# EAGLE design shift_regs (EAGLE 5.10)

## Sheet 1 of 3
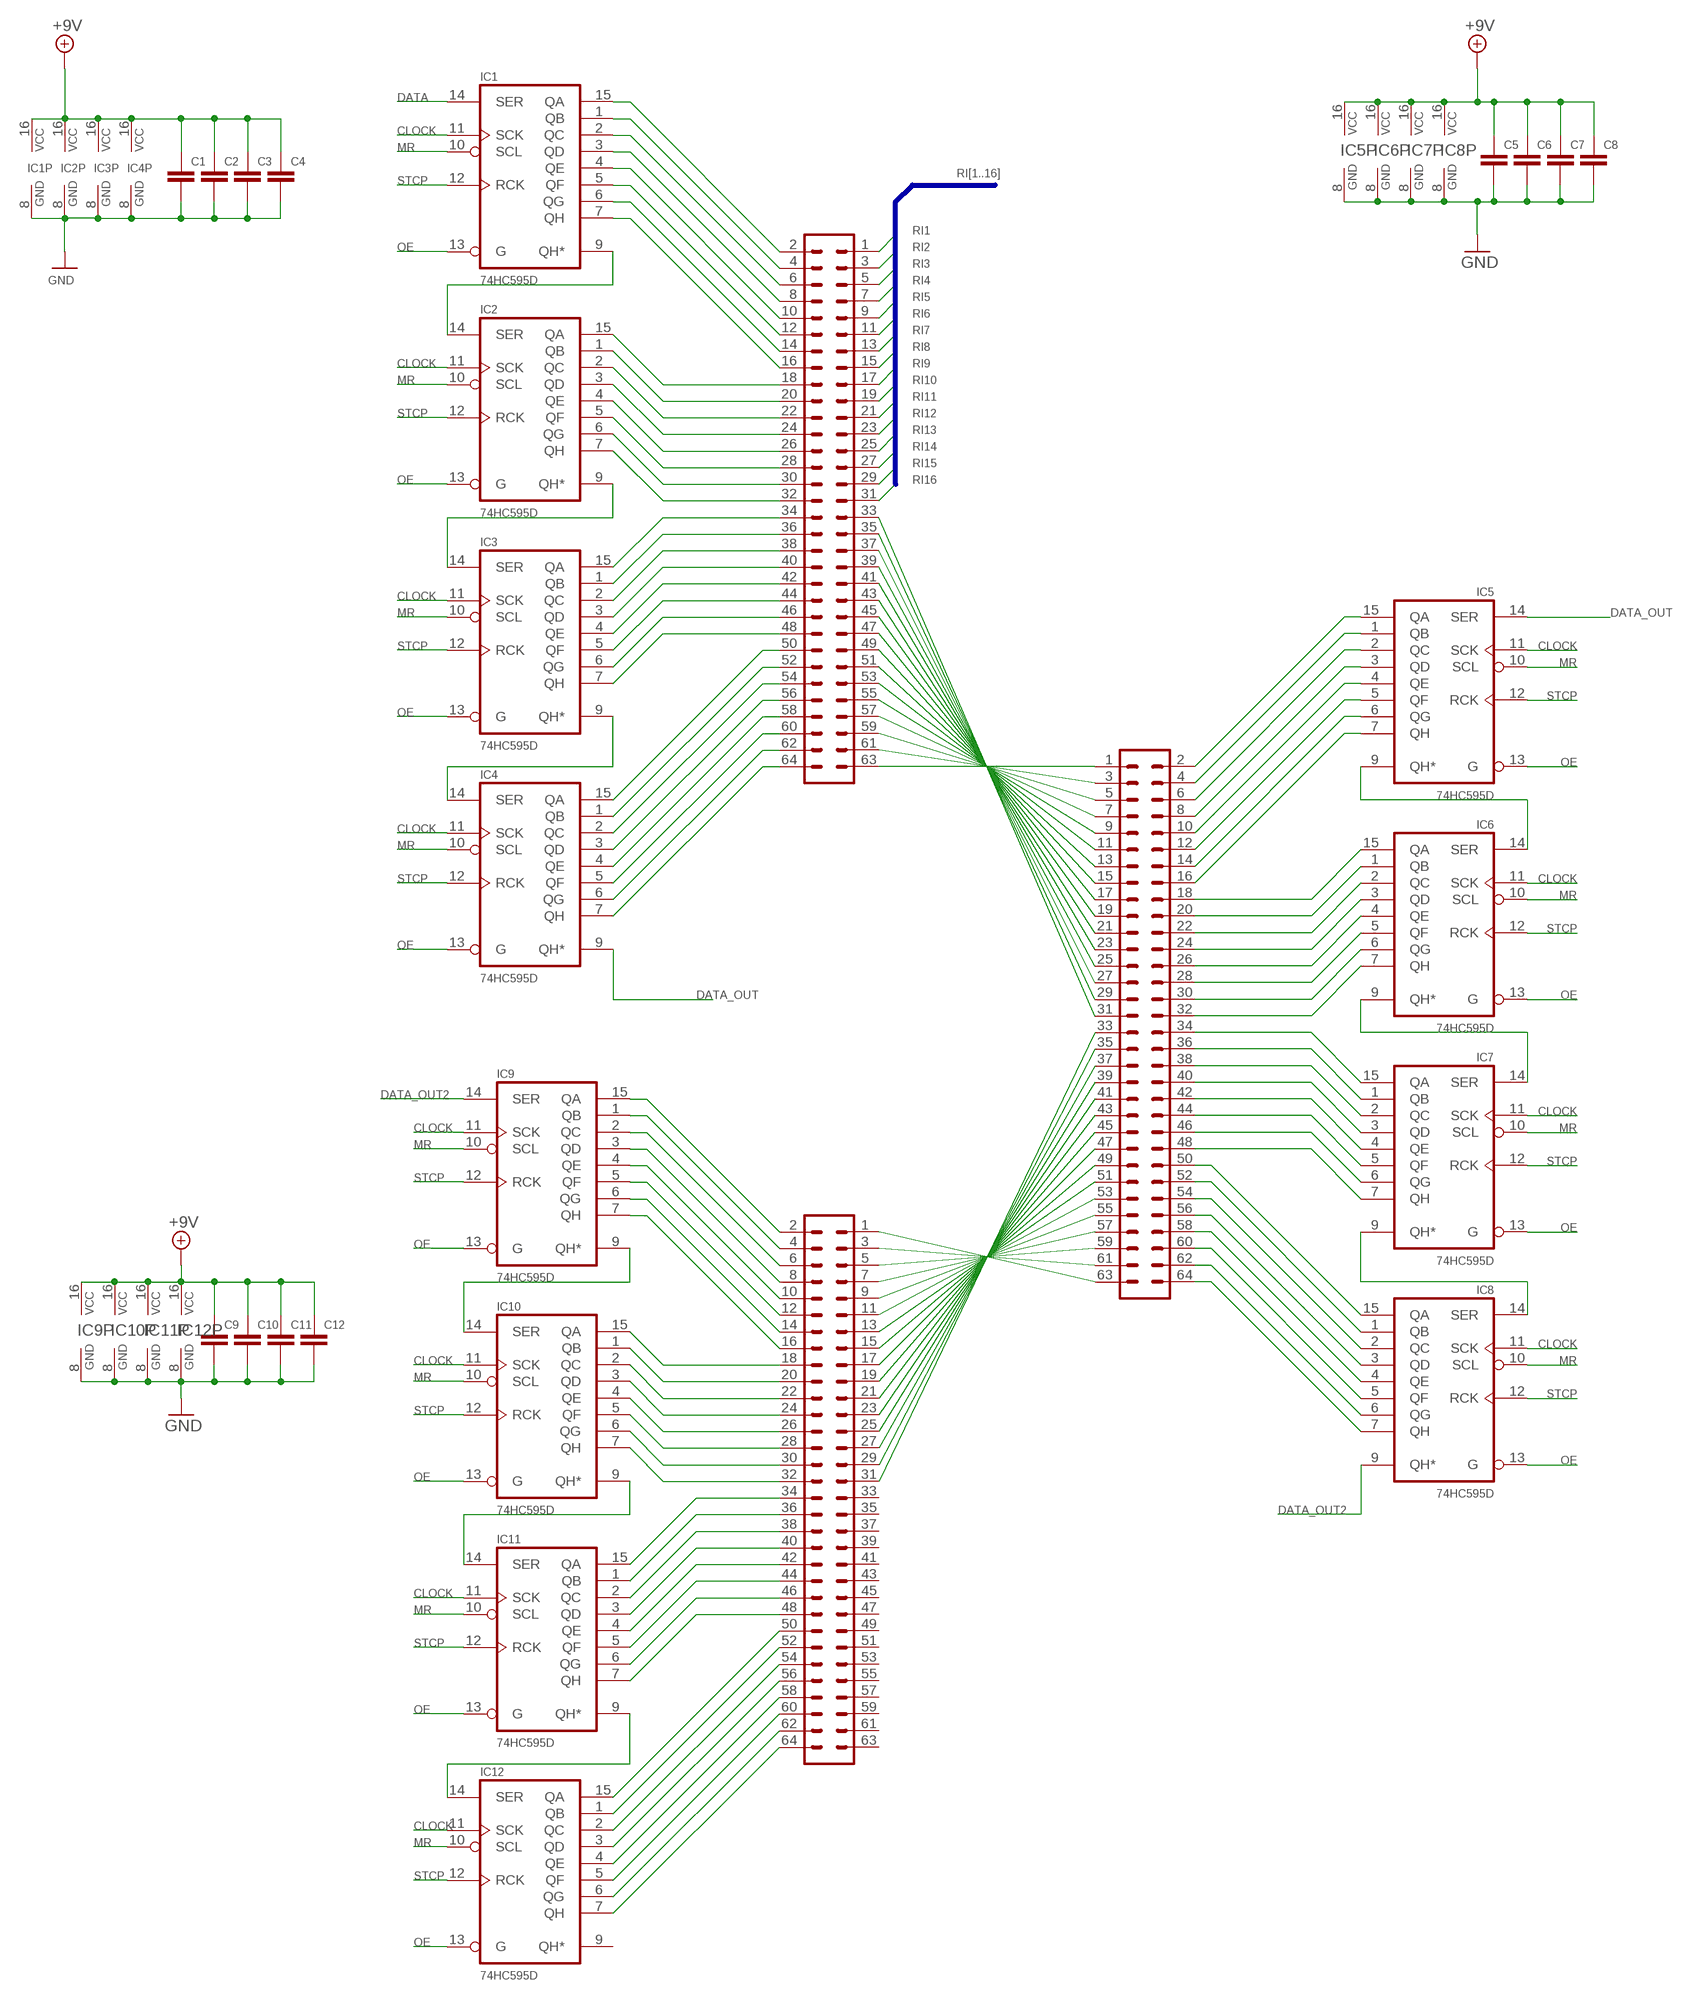
[diagram p0: schematic, sheet 1]

### Parts
C1  C-EUC0805  [C0805]
C2  C-EUC0805  [C0805]
C3  C-EUC0805  [C0805]
C4  C-EUC0805  [C0805]
C5  C-EUC0805  [C0805]
C6  C-EUC0805  [C0805]
C7  C-EUC0805  [C0805]
C8  C-EUC0805  [C0805]
C9  C-EUC0805  [C0805]
C10  C-EUC0805  [C0805]
C11  C-EUC0805  [C0805]
C12  C-EUC0805  [C0805]
IC1  74HC595D  [SO16]
IC2  74HC595D  [SO16]
IC3  74HC595D  [SO16]
IC4  74HC595D  [SO16]
IC5  74HC595D  [SO16]
IC6  74HC595D  [SO16]
IC7  74HC595D  [SO16]
IC8  74HC595D  [SO16]
IC9  74HC595D  [SO16]
IC10  74HC595D  [SO16]
IC11  74HC595D  [SO16]
IC12  74HC595D  [SO16]
SV1  ML64  [ML64]
SV2  ML64  [ML64]
SV3  ML64  [ML64]

### Nets
+9V: C1.1 C2.1 C3.1 C4.1 C5.1 C6.1 C7.1 C8.1 C9.1 C10.1 C11.1 C12.1 IC1.16(VCC) IC2.16(VCC) IC3.16(VCC) IC4.16(VCC) IC5.16(VCC) IC6.16(VCC) IC7.16(VCC) IC8.16(VCC) IC9.16(VCC) IC10.16(VCC) IC11.16(VCC) IC12.16(VCC) ; also sheet 3
CLOCK: IC1.11(SCK) IC2.11(SCK) IC3.11(SCK) IC4.11(SCK) IC5.11(SCK) IC6.11(SCK) IC7.11(SCK) IC8.11(SCK) IC9.11(SCK) IC10.11(SCK) IC11.11(SCK) IC12.11(SCK) ; also sheet 3
DATA: IC1.14(SER) ; also sheet 3
DATA_OUT: IC4.9(QH*) IC5.14(SER)
DATA_OUT2: IC8.9(QH*) IC9.14(SER)
GND: C1.2 C2.2 C3.2 C4.2 C5.2 C6.2 C7.2 C8.2 C9.2 C10.2 C11.2 C12.2 IC1.8(GND) IC2.8(GND) IC3.8(GND) IC4.8(GND) IC5.8(GND) IC6.8(GND) IC7.8(GND) IC8.8(GND) IC9.8(GND) IC10.8(GND) IC11.8(GND) IC12.8(GND) ; also sheet 2,3
MR: IC1.10(SCL) IC2.10(SCL) IC3.10(SCL) IC4.10(SCL) IC5.10(SCL) IC6.10(SCL) IC7.10(SCL) IC8.10(SCL) IC9.10(SCL) IC10.10(SCL) IC11.10(SCL) IC12.10(SCL) ; also sheet 3
N$1: IC1.9(QH*) IC2.14(SER)
N$2: IC2.9(QH*) IC3.14(SER)
N$3: IC3.9(QH*) IC4.14(SER)
N$5: IC1.1(QB) SV1.4
N$6: IC1.2(QC) SV1.6
N$7: IC1.3(QD) SV1.8
N$8: IC1.4(QE) SV1.10
N$9: IC1.5(QF) SV1.12
N$10: IC1.6(QG) SV1.14
N$11: IC1.7(QH) SV1.16
N$12: IC1.15(QA) SV1.2
N$13: IC2.1(QB) SV1.20
N$14: IC2.2(QC) SV1.22
N$15: IC2.3(QD) SV1.24
N$16: IC2.4(QE) SV1.26
N$17: IC2.5(QF) SV1.28
N$18: IC2.6(QG) SV1.30
N$19: IC2.7(QH) SV1.32
N$20: IC2.15(QA) SV1.18
N$21: IC3.1(QB) SV1.36
N$22: IC3.2(QC) SV1.38
N$23: IC3.3(QD) SV1.40
N$24: IC3.4(QE) SV1.42
N$25: IC3.5(QF) SV1.44
N$26: IC3.6(QG) SV1.46
N$27: IC3.7(QH) SV1.48
N$28: IC3.15(QA) SV1.34
N$29: IC4.1(QB) SV1.52
N$30: IC4.2(QC) SV1.54
N$31: IC4.3(QD) SV1.56
N$32: IC4.4(QE) SV1.58
N$33: IC4.5(QF) SV1.60
N$34: IC4.6(QG) SV1.62
N$35: IC4.7(QH) SV1.64
N$36: IC4.15(QA) SV1.50
N$37: IC5.9(QH*) IC6.14(SER)
N$38: IC6.9(QH*) IC7.14(SER)
N$39: IC7.9(QH*) IC8.14(SER)
N$40: IC5.1(QB) SV2.4
N$41: IC5.2(QC) SV2.6
N$42: IC5.3(QD) SV2.8
N$43: IC5.4(QE) SV2.10
N$44: IC5.5(QF) SV2.12
N$45: IC5.6(QG) SV2.14
N$46: IC5.7(QH) SV2.16
N$47: IC5.15(QA) SV2.2
N$48: IC6.1(QB) SV2.20
N$49: IC6.2(QC) SV2.22
N$50: IC6.3(QD) SV2.24
N$51: IC6.4(QE) SV2.26
N$52: IC6.5(QF) SV2.28
N$53: IC6.6(QG) SV2.30
N$54: IC6.7(QH) SV2.32
N$55: IC6.15(QA) SV2.18
N$56: IC7.1(QB) SV2.36
N$57: IC7.2(QC) SV2.38
N$58: IC7.3(QD) SV2.40
N$59: IC7.4(QE) SV2.42
N$60: IC7.5(QF) SV2.44
N$61: IC7.6(QG) SV2.46
N$62: IC7.7(QH) SV2.48
N$63: IC7.15(QA) SV2.34
N$64: IC8.1(QB) SV2.52
N$65: IC8.2(QC) SV2.54
N$66: IC8.3(QD) SV2.56
N$67: IC8.4(QE) SV2.58
N$68: IC8.5(QF) SV2.60
N$69: IC8.6(QG) SV2.62
N$70: IC8.7(QH) SV2.64
N$71: IC8.15(QA) SV2.50
N$72: SV1.63 SV2.1
N$73: SV1.61 SV2.3
N$74: SV1.59 SV2.5
N$75: SV1.57 SV2.7
N$76: SV1.55 SV2.9
N$77: SV1.53 SV2.11
N$78: SV1.51 SV2.13
N$79: SV1.49 SV2.15
N$80: SV1.47 SV2.17
N$81: SV1.45 SV2.19
N$82: SV1.43 SV2.21
N$83: SV1.41 SV2.23
N$84: SV1.39 SV2.25
N$85: SV1.37 SV2.27
N$86: SV1.35 SV2.29
N$87: SV1.33 SV2.31
N$88: IC9.9(QH*) IC10.14(SER)
N$89: IC10.9(QH*) IC11.14(SER)
N$90: IC11.9(QH*) IC12.14(SER)
N$91: IC9.1(QB) SV3.4
N$92: IC9.2(QC) SV3.6
N$93: IC9.3(QD) SV3.8
N$94: IC9.4(QE) SV3.10
N$95: IC9.5(QF) SV3.12
N$96: IC9.6(QG) SV3.14
N$97: IC9.7(QH) SV3.16
N$98: IC9.15(QA) SV3.2
N$99: IC10.1(QB) SV3.20
N$100: IC10.2(QC) SV3.22
N$101: IC10.3(QD) SV3.24
N$102: IC10.4(QE) SV3.26
N$103: IC10.5(QF) SV3.28
N$104: IC10.6(QG) SV3.30
N$105: IC10.7(QH) SV3.32
N$106: IC10.15(QA) SV3.18
N$107: IC11.1(QB) SV3.36
N$108: IC11.2(QC) SV3.38
N$109: IC11.3(QD) SV3.40
N$110: IC11.4(QE) SV3.42
N$111: IC11.5(QF) SV3.44
N$112: IC11.6(QG) SV3.46
N$113: IC11.7(QH) SV3.48
N$114: IC11.15(QA) SV3.34
N$115: IC12.1(QB) SV3.52
N$116: IC12.2(QC) SV3.54
N$117: IC12.3(QD) SV3.56
N$118: IC12.4(QE) SV3.58
N$119: IC12.5(QF) SV3.60
N$120: IC12.6(QG) SV3.62
N$121: IC12.7(QH) SV3.64
N$122: IC12.15(QA) SV3.50
N$123: SV2.33 SV3.31
N$124: SV2.35 SV3.29
N$125: SV2.37 SV3.27
N$126: SV2.39 SV3.25
N$127: SV2.41 SV3.23
N$128: SV2.43 SV3.21
N$129: SV2.45 SV3.19
N$130: SV2.47 SV3.17
N$131: SV2.49 SV3.15
N$132: SV2.51 SV3.13
N$133: SV2.53 SV3.11
N$134: SV2.55 SV3.9
N$135: SV2.57 SV3.7
N$136: SV2.59 SV3.5
N$137: SV2.61 SV3.3
N$138: SV2.63 SV3.1
OE: IC1.13(G) IC2.13(G) IC3.13(G) IC4.13(G) IC5.13(G) IC6.13(G) IC7.13(G) IC8.13(G) IC9.13(G) IC10.13(G) IC11.13(G) IC12.13(G) ; also sheet 3
RI1: SV1.1 ; also sheet 2
RI2: SV1.3 ; also sheet 2
RI3: SV1.5 ; also sheet 2
RI4: SV1.7 ; also sheet 2
RI5: SV1.9 ; also sheet 2
RI6: SV1.11 ; also sheet 2
RI7: SV1.13 ; also sheet 2
RI8: SV1.15 ; also sheet 2
RI9: SV1.17 ; also sheet 2
RI10: SV1.19 ; also sheet 2
RI11: SV1.21 ; also sheet 2
RI12: SV1.23 ; also sheet 2
RI13: SV1.25 ; also sheet 2
RI14: SV1.27 ; also sheet 2
RI15: SV1.29 ; also sheet 2
RI16: SV1.31 ; also sheet 2
STCP: IC1.12(RCK) IC2.12(RCK) IC3.12(RCK) IC4.12(RCK) IC5.12(RCK) IC6.12(RCK) IC7.12(RCK) IC8.12(RCK) IC9.12(RCK) IC10.12(RCK) IC11.12(RCK) IC12.12(RCK) ; also sheet 3
Unconnected: IC12.9(QH*) SV3.33 SV3.35 SV3.37 SV3.39 SV3.41 SV3.43 SV3.45 SV3.47 SV3.49 SV3.51 SV3.53 SV3.55 SV3.57 SV3.59 SV3.61 SV3.63

### Buses
RI[1..16]

## Sheet 2 of 3
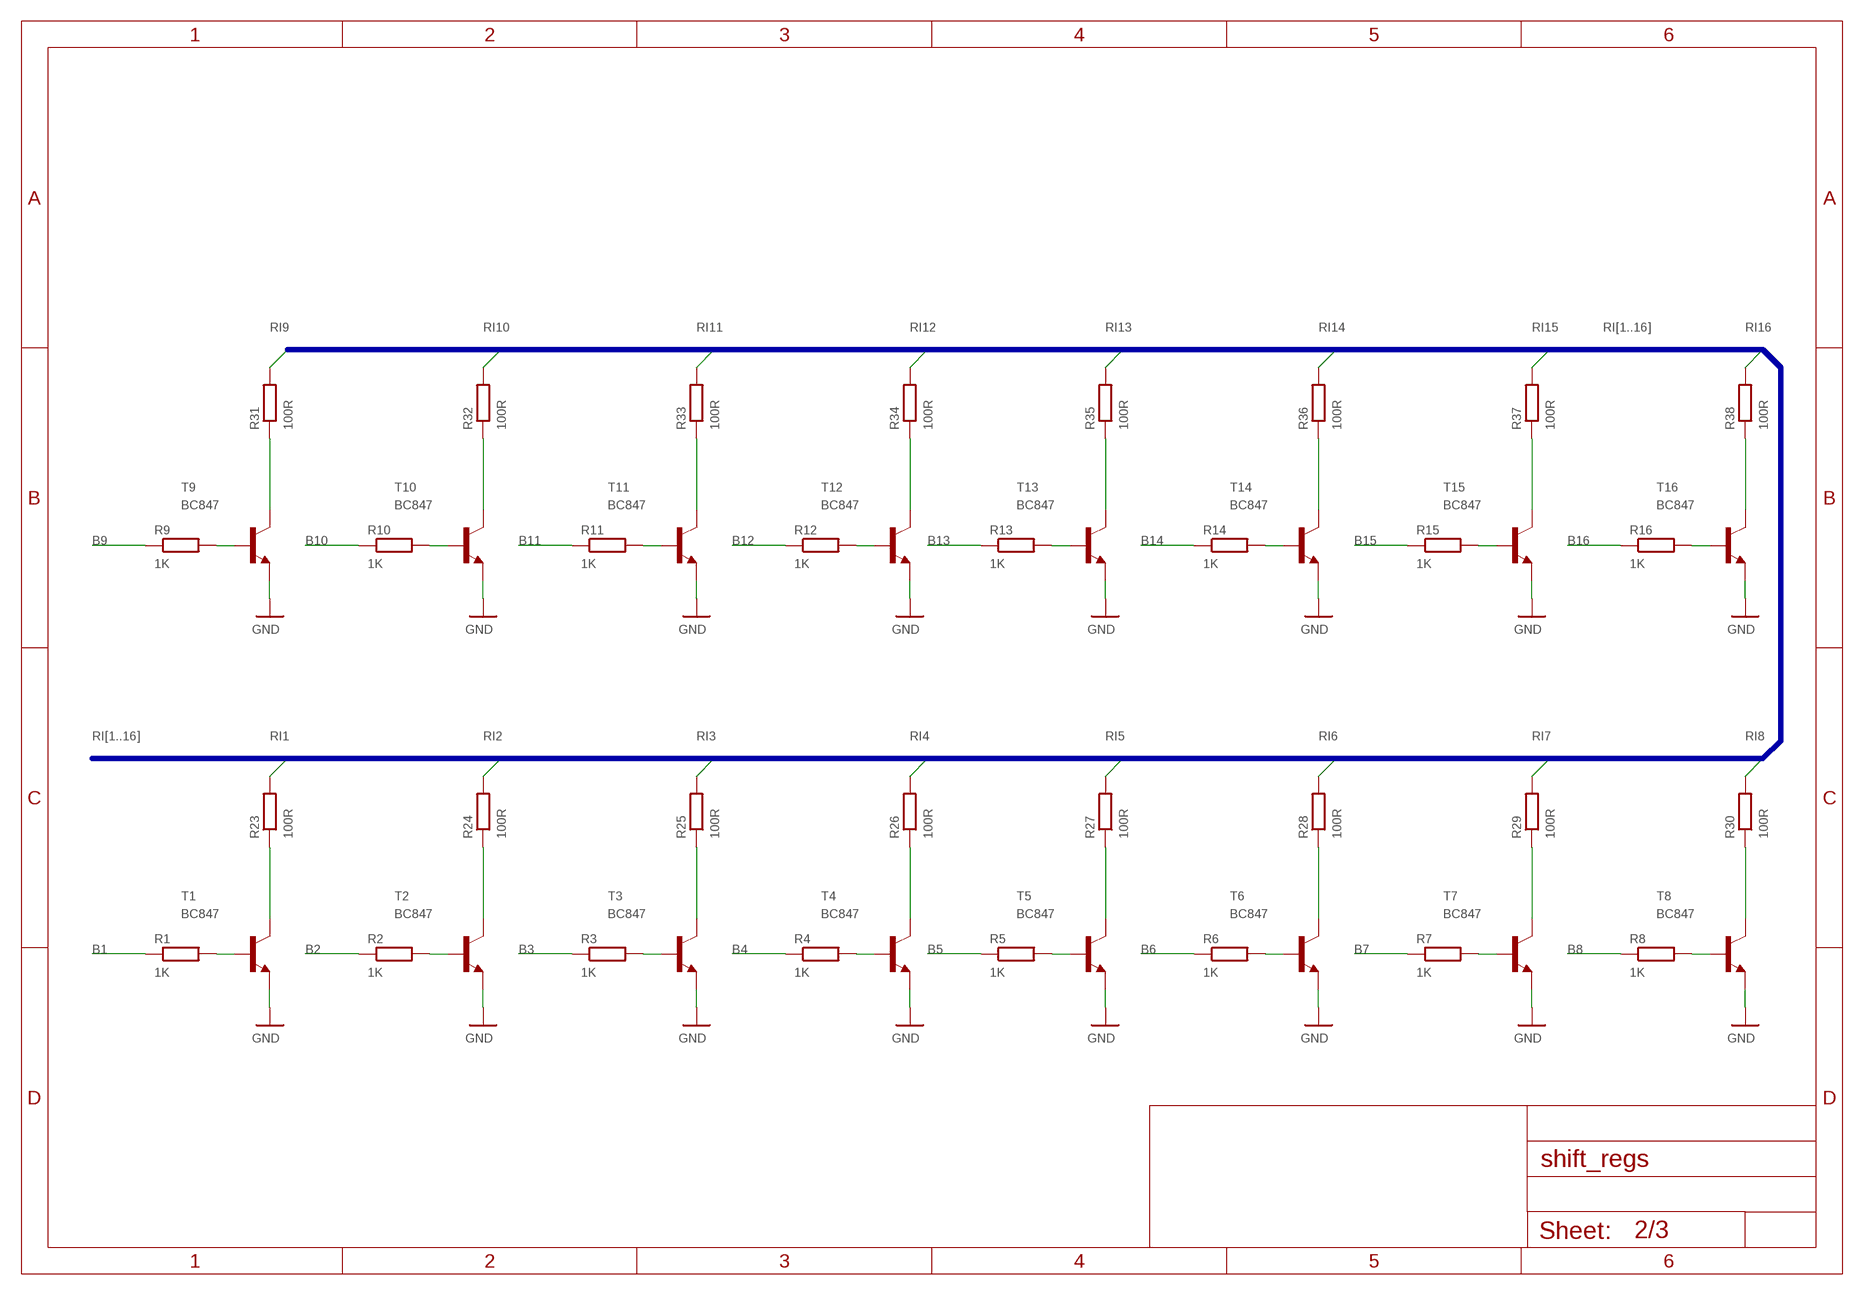
[diagram p1: schematic, sheet 2]

### Parts
R1  1K  R-EU_R0805  [R0805]
R2  1K  R-EU_R0805  [R0805]
R3  1K  R-EU_R0805  [R0805]
R4  1K  R-EU_R0805  [R0805]
R5  1K  R-EU_R0805  [R0805]
R6  1K  R-EU_R0805  [R0805]
R7  1K  R-EU_R0805  [R0805]
R8  1K  R-EU_R0805  [R0805]
R9  1K  R-EU_R0805  [R0805]
R10  1K  R-EU_R0805  [R0805]
R11  1K  R-EU_R0805  [R0805]
R12  1K  R-EU_R0805  [R0805]
R13  1K  R-EU_R0805  [R0805]
R14  1K  R-EU_R0805  [R0805]
R15  1K  R-EU_R0805  [R0805]
R16  1K  R-EU_R0805  [R0805]
R23  100R  R-EU_R0805  [R0805]
R24  100R  R-EU_R0805  [R0805]
R25  100R  R-EU_R0805  [R0805]
R26  100R  R-EU_R0805  [R0805]
R27  100R  R-EU_R0805  [R0805]
R28  100R  R-EU_R0805  [R0805]
R29  100R  R-EU_R0805  [R0805]
R30  100R  R-EU_R0805  [R0805]
R31  100R  R-EU_R0805  [R0805]
R32  100R  R-EU_R0805  [R0805]
R33  100R  R-EU_R0805  [R0805]
R34  100R  R-EU_R0805  [R0805]
R35  100R  R-EU_R0805  [R0805]
R36  100R  R-EU_R0805  [R0805]
R37  100R  R-EU_R0805  [R0805]
R38  100R  R-EU_R0805  [R0805]
T1  BC847  [SOT23]
T2  BC847  [SOT23]
T3  BC847  [SOT23]
T4  BC847  [SOT23]
T5  BC847  [SOT23]
T6  BC847  [SOT23]
T7  BC847  [SOT23]
T8  BC847  [SOT23]
T9  BC847  [SOT23]
T10  BC847  [SOT23]
T11  BC847  [SOT23]
T12  BC847  [SOT23]
T13  BC847  [SOT23]
T14  BC847  [SOT23]
T15  BC847  [SOT23]
T16  BC847  [SOT23]

### Nets
B1: R1.1 ; also sheet 3
B2: R2.1 ; also sheet 3
B3: R3.1 ; also sheet 3
B4: R4.1 ; also sheet 3
B5: R5.1 ; also sheet 3
B6: R6.1 ; also sheet 3
B7: R7.1 ; also sheet 3
B8: R8.1 ; also sheet 3
B9: R9.1 ; also sheet 3
B10: R10.1 ; also sheet 3
B11: R11.1 ; also sheet 3
B12: R12.1 ; also sheet 3
B13: R13.1 ; also sheet 3
B14: R14.1 ; also sheet 3
B15: R15.1 ; also sheet 3
B16: R16.1 ; also sheet 3
GND: T1.2(E) T2.2(E) T3.2(E) T4.2(E) T5.2(E) T6.2(E) T7.2(E) T8.2(E) T9.2(E) T10.2(E) T11.2(E) T12.2(E) T13.2(E) T14.2(E) T15.2(E) T16.2(E) ; also sheet 1,3
N$139: R1.2 T1.1(B)
N$141: R2.2 T2.1(B)
N$142: R3.2 T3.1(B)
N$143: R4.2 T4.1(B)
N$144: R5.2 T5.1(B)
N$145: R6.2 T6.1(B)
N$146: R7.2 T7.1(B)
N$147: R8.2 T8.1(B)
N$148: R9.2 T9.1(B)
N$149: R10.2 T10.1(B)
N$150: R11.2 T11.1(B)
N$151: R12.2 T12.1(B)
N$152: R13.2 T13.1(B)
N$153: R14.2 T14.1(B)
N$154: R15.2 T15.1(B)
N$155: R16.2 T16.1(B)
N$159: R23.1 T1.3(C)
N$160: R24.1 T2.3(C)
N$161: R25.1 T3.3(C)
N$162: R26.1 T4.3(C)
N$163: R27.1 T5.3(C)
N$164: R28.1 T6.3(C)
N$165: R29.1 T7.3(C)
N$166: R30.1 T8.3(C)
N$167: R31.1 T9.3(C)
N$168: R32.1 T10.3(C)
N$169: R33.1 T11.3(C)
N$170: R34.1 T12.3(C)
N$171: R35.1 T13.3(C)
N$172: R36.1 T14.3(C)
N$173: R37.1 T15.3(C)
N$174: R38.1 T16.3(C)
RI1: R23.2 ; also sheet 1
RI2: R24.2 ; also sheet 1
RI3: R25.2 ; also sheet 1
RI4: R26.2 ; also sheet 1
RI5: R27.2 ; also sheet 1
RI6: R28.2 ; also sheet 1
RI7: R29.2 ; also sheet 1
RI8: R30.2 ; also sheet 1
RI9: R31.2 ; also sheet 1
RI10: R32.2 ; also sheet 1
RI11: R33.2 ; also sheet 1
RI12: R34.2 ; also sheet 1
RI13: R35.2 ; also sheet 1
RI14: R36.2 ; also sheet 1
RI15: R37.2 ; also sheet 1
RI16: R38.2 ; also sheet 1

### Buses
RI[1..16]

## Sheet 3 of 3
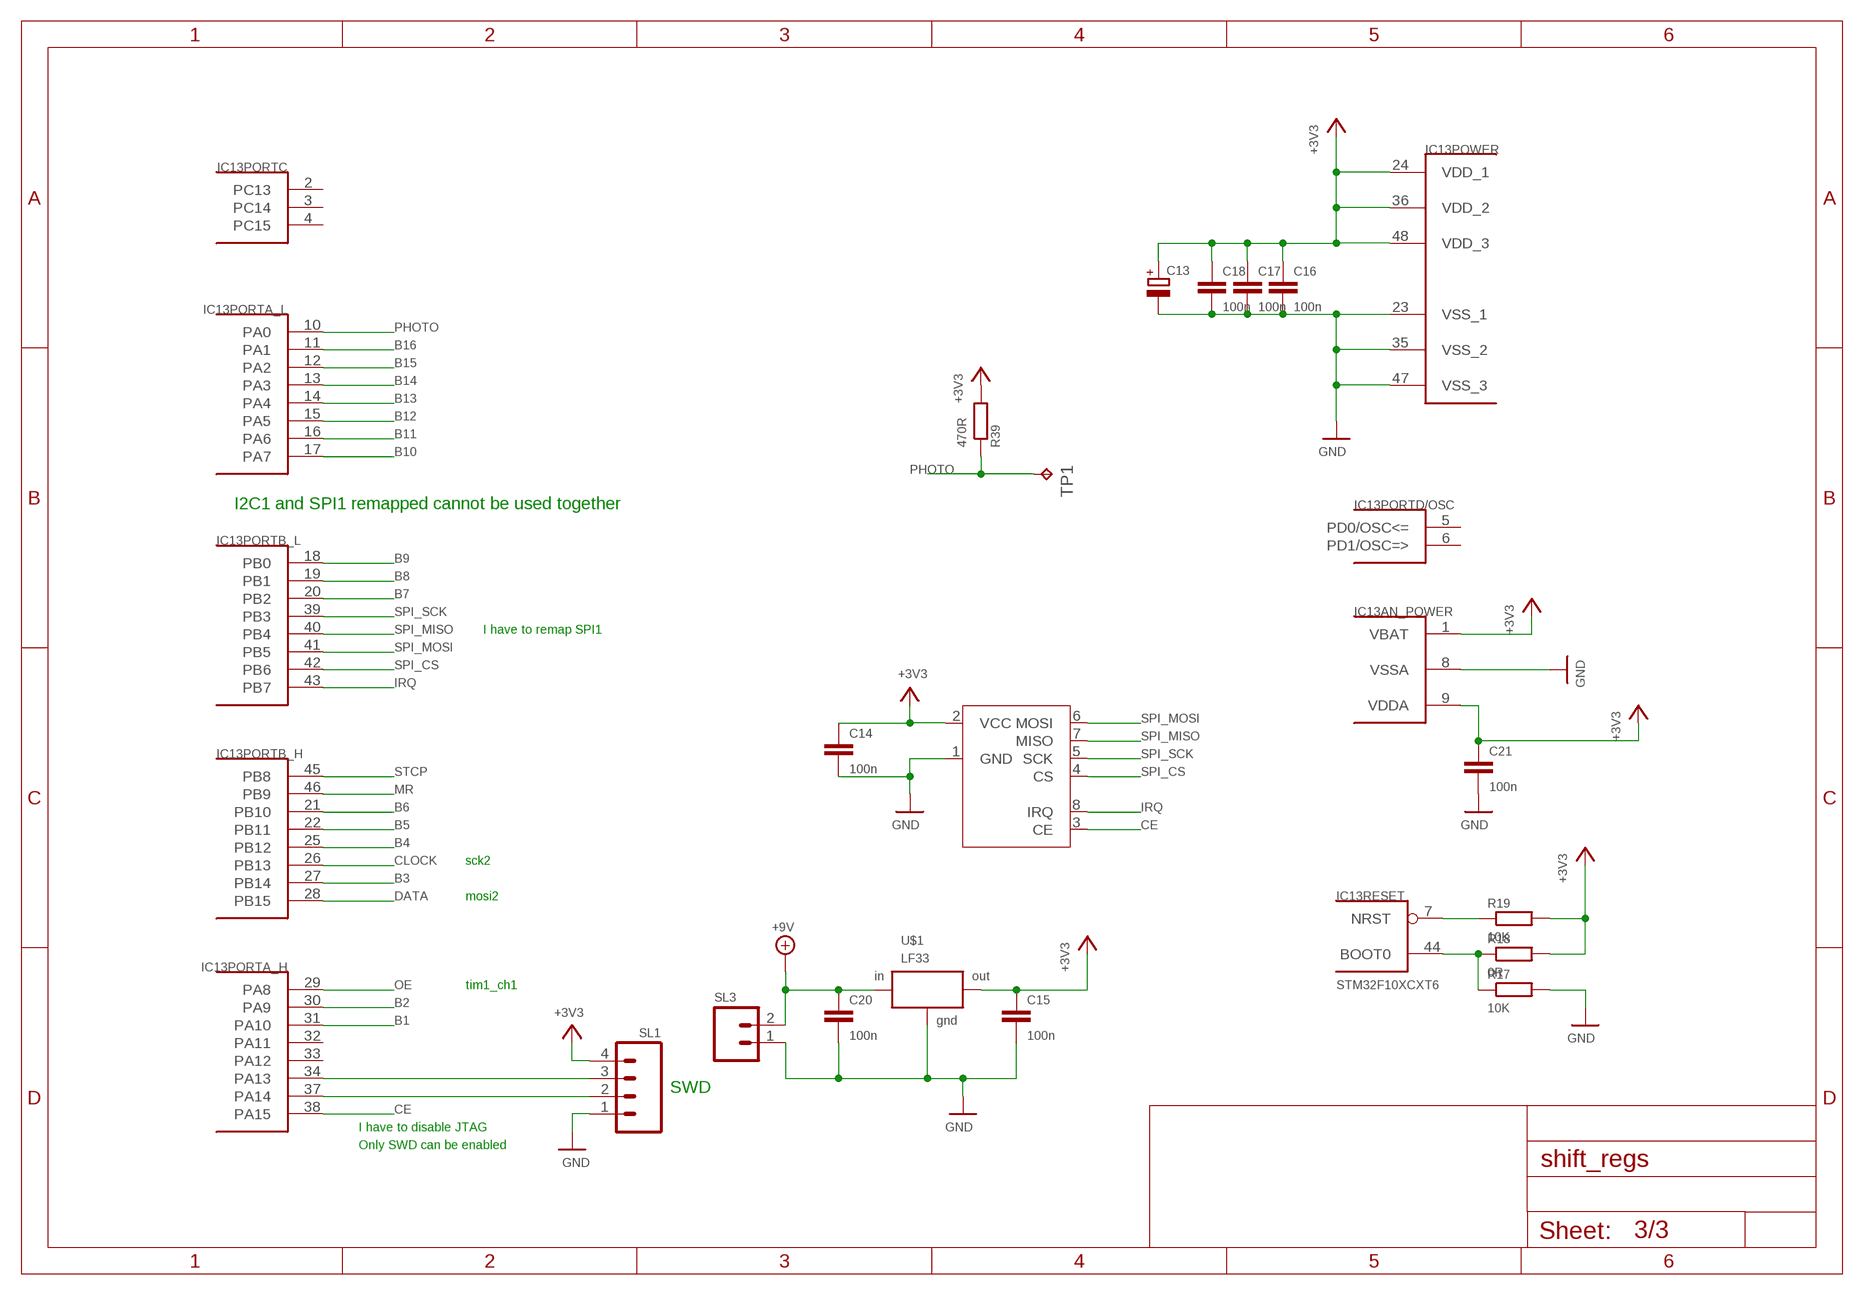
[diagram p2: schematic, sheet 3]

### Parts
C13  CPOL-EUE2.5-6  [E2,5-6]
C14  100n  C-EUC0805  [C0805]
C15  100n  C-EUC0805  [C0805]
C16  100n  C-EUC0805  [C0805]
C17  100n  C-EUC0805  [C0805]
C18  100n  C-EUC0805  [C0805]
C20  100n  C-EUC0805  [C0805]
C21  100n  C-EUC0805  [C0805]
IC13  STM32F10XCXT6  [TQFP48]
IC14  NRF24L01  [NRF24L01]
R17  10K  R-EU_R0805  [R0805]
R18  0R  R-EU_R0805  [R0805]
R19  10K  R-EU_R0805  [R0805]
R39  470R  R-EU_R0805  [R0805]
SL1  M04  [04P]
SL3  M02  [02P]
TP1  TPB1,27  [B1,27]
U$1  LF33  [DPACK]

### Nets
+3V3: C13.+ C14.1 C15.1 C16.1 C17.1 C18.1 C21.1 IC13.1(AN_POWER:VBAT) IC13.9(AN_POWER:VDDA) IC13.24(POWER:VDD_1) IC13.36(POWER:VDD_2) IC13.48(POWER:VDD_3) IC14.2(VCC) R18.2 R19.2 R39.2 SL1.4 U$1.3(OUT)
+9V: C20.1 SL3.2 U$1.1(IN) ; also sheet 1
B1: IC13.31(PORTA_H:PA10) ; also sheet 2
B2: IC13.30(PORTA_H:PA9) ; also sheet 2
B3: IC13.27(PORTB_H:PB14) ; also sheet 2
B4: IC13.25(PORTB_H:PB12) ; also sheet 2
B5: IC13.22(PORTB_H:PB11) ; also sheet 2
B6: IC13.21(PORTB_H:PB10) ; also sheet 2
B7: IC13.20(PORTB_L:PB2) ; also sheet 2
B8: IC13.19(PORTB_L:PB1) ; also sheet 2
B9: IC13.18(PORTB_L:PB0) ; also sheet 2
B10: IC13.17(PORTA_L:PA7) ; also sheet 2
B11: IC13.16(PORTA_L:PA6) ; also sheet 2
B12: IC13.15(PORTA_L:PA5) ; also sheet 2
B13: IC13.14(PORTA_L:PA4) ; also sheet 2
B14: IC13.13(PORTA_L:PA3) ; also sheet 2
B15: IC13.12(PORTA_L:PA2) ; also sheet 2
B16: IC13.11(PORTA_L:PA1) ; also sheet 2
CE: IC13.38(PORTA_H:PA15) IC14.3(CE)
CLOCK: IC13.26(PORTB_H:PB13) ; also sheet 1
DATA: IC13.28(PORTB_H:PB15) ; also sheet 1
GND: C13.- C14.2 C15.2 C16.2 C17.2 C18.2 C20.2 C21.2 IC13.8(AN_POWER:VSSA) IC13.23(POWER:VSS_1) IC13.35(POWER:VSS_2) IC13.47(POWER:VSS_3) IC14.1(GND) R17.2 SL1.1 SL3.1 U$1.2(GND) ; also sheet 1,2
IRQ: IC13.43(PORTB_L:PB7) IC14.8(IRQ)
MR: IC13.46(PORTB_H:PB9) ; also sheet 1
N$140: IC13.44(RESET:BOOT0) R17.1 R18.1
NRST: IC13.7(RESET:NRST) R19.1
OE: IC13.29(PORTA_H:PA8) ; also sheet 1
PHOTO: IC13.10(PORTA_L:PA0) R39.1 TP1.TP
SPI_CS: IC13.42(PORTB_L:PB6) IC14.4(CS)
SPI_MISO: IC13.40(PORTB_L:PB4) IC14.7(MISO)
SPI_MOSI: IC13.41(PORTB_L:PB5) IC14.6(MOSI)
SPI_SCK: IC13.39(PORTB_L:PB3) IC14.5(SCK)
STCP: IC13.45(PORTB_H:PB8) ; also sheet 1
SWDCLK: IC13.37(PORTA_H:PA14) SL1.2
SWDIO: IC13.34(PORTA_H:PA13) SL1.3
Unconnected: IC13.2(PORTC:PC13) IC13.3(PORTC:PC14) IC13.4(PORTC:PC15) IC13.5(PORTD/OSC:PD0/OSC<=) IC13.6(PORTD/OSC:PD1/OSC=>) IC13.32(PORTA_H:PA11) IC13.33(PORTA_H:PA12)

### Notes on the sheet
- I2C1 and SPI1 remapped cannot be used together
- I have to remap SPI1
- sck2
- mosi2
- tim1_ch1
- SWD
- I have to disable JTAG
- Only SWD can be enabled

## Library data of the parts
C1-C12 C14-C18 C20 C21 = rcl:C-EU: CAPACITOR, European symbol
C13 = rcl:CPOL-EU: POLARIZED CAPACITOR, European symbol
IC1-IC12 = 74xx-eu:74*595: 8-bit SHIFT REGISTER, output latch
IC13 = stm32:STM32F10XCXT6: ST STM32F101/103 48pin LQFP
IC14 = Kuba:NRF24L01
R1-R19 R23-R39 = rcl:R-EU_: RESISTOR, European symbol
SL1 = con-amp-quick:M04: AMP QUICK CONNECTOR
SL3 = con-amp-quick:M02: AMP QUICK CONNECTOR
SV1-SV3 = con-harting-ml:ML64: HARTING
T1-T16 = transistor:BC847: NPN TRANSISTOR
TP1 = testpad:TP: Test pad
U$1 = custom111027a:LF33: VERY LOW DROP VOLTAGE REGULATORS WITH INHIBIT 3,3V > VERY LOW DROPOUT VOLTAGE (0.45V) > VERY LOW QUIESCENT CURRENT (TYP. > 50 ?A IN OFF MODE, 500 ?A IN ON MODE) > OUTPUT CURRENT UP TO 500 mA > INTERNAL CURRENT AND THERMAL LIMIT > ONLY 2.2 ?F FOR STABILITY > AVAILABLE IN ± 1% (AB) OR ± 2% (C) SELECTION AT 25 °C > SUPPLY VOLTAGE REJECTION: 80db (TYP.) > TEMPERATURE RANGE: -40 TO 125 °C

## Board
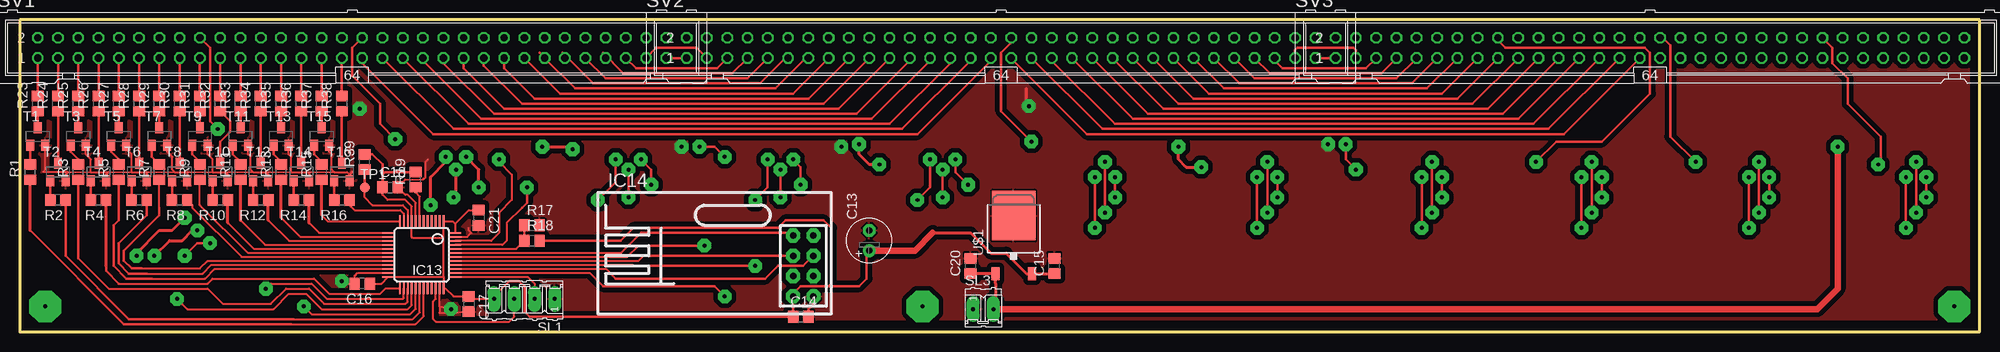
[diagram p3: board, top side]
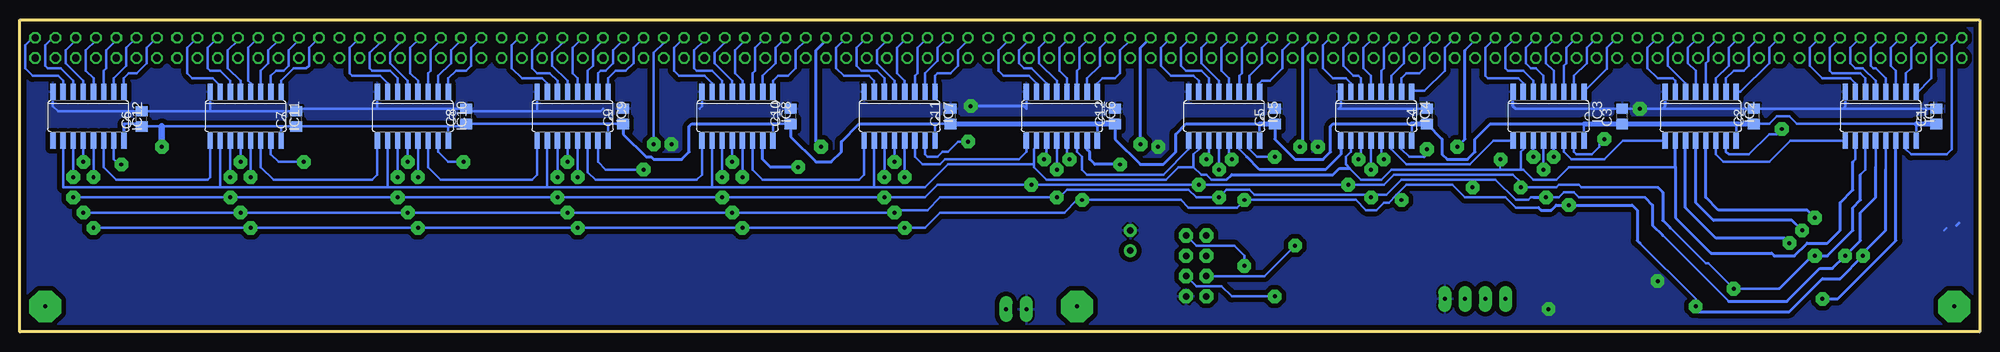
[diagram p4: board, bottom side, seen from below]

Size 245.43 x 39.05 mm. Coordinates in mm from the lower left corner, seen from the top.
Outline: 0,0 245.43,0 245.43,39.05 0,39.05 0,0
Copper layers (1*16): Top 0.035mm / dielectric 1.5mm / Bottom 0.035mm
Design rules "default *": minimum track width 10mil, minimum drill 10mil, track to track 8mil, track to pad 8mil, pad to pad 8mil, via to via 8mil, smd to smd 0mil, copper to edge 10mil, drill to drill 8mil, minimum pad ring 10mil, minimum via ring 8mil, stop-mask expansion 4mil, vias tented up to drill 0mil, thermal gap 10mil

### Footprints (pad centres in the part's own frame; a part is rotated, then mirrored left to right if it is on the bottom)
C0805 = smd 1.3 x 1.5: 1 -0.95,0; 2 0.95,0
E2,5-6 = drill 0.813 pad 1.6 round: + -1.27,0 | drill 0.813 pad 1.6 octagon: - 1.27,0
SO16 = smd 0.66 x 2.032: 1 -4.445,-3.073; 2 -3.175,-3.073; 3 -1.905,-3.073; 4 -0.635,-3.073; 5 0.635,-3.073; 6 1.905,-3.073; 7 3.175,-3.073; 8 4.445,-3.073; 9 4.445,3.073; 10 3.175,3.073; 11 1.905,3.073; 12 0.635,3.073; 13 -0.635,3.073; 14 -1.905,3.073; 15 -3.175,3.073; 16 -4.445,3.073
TQFP48 = smd 0.2 x 1.5: 1 -2.75,-4.183; 2 -2.25,-4.183; 3 -1.75,-4.183; 4 -1.25,-4.183; 5 -0.75,-4.183; 6 -0.25,-4.183; 7 0.25,-4.183; 8 0.75,-4.183; 9 1.25,-4.183; 10 1.75,-4.183; 11 2.25,-4.183; 12 2.75,-4.183; 25 2.75,4.183; 26 2.25,4.183; 27 1.75,4.183; 28 1.25,4.183; 29 0.75,4.183; 30 0.25,4.183; 31 -0.25,4.183; 32 -0.75,4.183; 33 -1.25,4.183; 34 -1.75,4.183; 35 -2.25,4.183; 36 -2.75,4.183 | smd 1.5 x 0.2: 13 4.183,-2.75; 14 4.183,-2.25; 15 4.183,-1.75; 16 4.183,-1.25; 17 4.183,-0.75; 18 4.183,-0.25; 19 4.183,0.25; 20 4.183,0.75; 21 4.183,1.25; 22 4.183,1.75; 23 4.183,2.25; 24 4.183,2.75; 37 -4.183,2.75; 38 -4.183,2.25; 39 -4.183,1.75; 40 -4.183,1.25; 41 -4.183,0.75; 42 -4.183,0.25; 43 -4.183,-0.25; 44 -4.183,-0.75; 45 -4.183,-1.25; 46 -4.183,-1.75; 47 -4.183,-2.25; 48 -4.183,-2.75
NRF24L01 = drill 0.813 pad 1.778 octagon: 1 0,0; 2 -2.54,0; 3 0,2.54; 4 -2.54,2.54; 5 0,5.08; 6 -2.54,5.08; 7 0,7.62; 8 -2.54,7.62
R0805 = smd 1.3 x 1.5: 1 -0.95,0; 2 0.95,0
04P = drill 0.5 pad 1.6 long: 1 -3.81,0; 2 -1.27,0; 3 1.27,0; 4 3.81,0
02P = drill 0.5 pad 1.6 long: 1 -1.27,0; 2 1.27,0
ML64 = drill 0.914 octagon: 1 -39.37,-1.27; 2 -39.37,1.27; 3 -36.83,-1.27; 4 -36.83,1.27; 5 -34.29,-1.27; 6 -34.29,1.27; 7 -31.75,-1.27; 8 -31.75,1.27; 9 -29.21,-1.27; 10 -29.21,1.27; 11 -26.67,-1.27; 12 -26.67,1.27; 13 -24.13,-1.27; 14 -24.13,1.27; 15 -21.59,-1.27; 16 -21.59,1.27; 17 -19.05,-1.27; 18 -19.05,1.27; 19 -16.51,-1.27; 20 -16.51,1.27; 21 -13.97,-1.27; 22 -13.97,1.27; 23 -11.43,-1.27; 24 -11.43,1.27; 25 -8.89,-1.27; 26 -8.89,1.27; 27 -6.35,-1.27; 28 -6.35,1.27; 29 -3.81,-1.27; 30 -3.81,1.27; 31 -1.27,-1.27; 32 -1.27,1.27; 33 1.27,-1.27; 34 1.27,1.27; 35 3.81,-1.27; 36 3.81,1.27; 37 6.35,-1.27; 38 6.35,1.27; 39 8.89,-1.27; 40 8.89,1.27; 41 11.43,-1.27; 42 11.43,1.27; 43 13.97,-1.27; 44 13.97,1.27; 45 16.51,-1.27; 46 16.51,1.27; 47 19.05,-1.27; 48 19.05,1.27; 49 21.59,-1.27; 50 21.59,1.27; 51 24.13,-1.27; 52 24.13,1.27; 53 26.67,-1.27; 54 26.67,1.27; 55 29.21,-1.27; 56 29.21,1.27; 57 31.75,-1.27; 58 31.75,1.27; 59 34.29,-1.27; 60 34.29,1.27; 61 36.83,-1.27; 62 36.83,1.27; 63 39.37,-1.27; 64 39.37,1.27
SOT23 = smd 1 x 1.4: 1 -0.95,-1.1; 2 0.95,-1.1; 3 0,1.1
B1,27 = smd 1.27 x 1.27: TP 0,0
DPACK = smd 1 x 1.6: 1 -2.28,-4.8; 3 2.28,-4.8 | smd 5.4 x 6.2: 2 0,2.5

### Placement (x,y rotation side)
C1  5.4,26.99 90 bottom
C2  28.26,26.99 90 bottom
C3  44.77,26.99 90 bottom
C4  69.22,26.99 90 bottom
C5  88.27,26.99 90 bottom
C6  230.19,26.67 90 bottom
C7  210.82,26.67 90 bottom
C8  189.55,26.99 90 bottom
C9  169.86,26.99 90 bottom
C10  148.91,26.99 90 bottom
C11  128.91,26.99 90 bottom
C12  108.27,26.99 90 bottom
C13  106.36,11.43 90 top
C14  97.79,1.91 0 top
C15  129.54,8.25 90 top
C16  42.86,6.03 180 top
C17  56.2,3.49 270 top
C18  46.35,18.1 0 top
C20  119.06,8.25 90 top
C21  57.47,14.29 270 top
IC1  12.38,26.99 180 bottom
IC2  34.92,26.99 180 bottom
IC3  53.98,26.99 180 bottom
IC4  75.56,26.99 180 bottom
IC5  94.61,26.99 180 bottom
IC6  114.94,26.99 180 bottom
IC7  135.25,26.99 180 bottom
IC8  155.57,26.99 180 bottom
IC9  176.21,26.99 180 bottom
IC10  196.22,26.99 180 bottom
IC11  217.17,26.99 180 bottom
IC12  236.85,26.99 180 bottom
IC13  50.31,9.64 180 top
IC14  99.38,4.45 0 top
R1  1.27,20 90 top
R2  4.76,16.51 180 top
R3  7.3,20 90 top
R4  9.84,16.51 180 top
R5  12.38,20 90 top
R6  14.92,16.51 180 top
R7  17.46,20 90 top
R8  20,16.51 180 top
R9  22.54,20 90 top
R10  25.08,16.51 180 top
R11  27.62,20 90 top
R12  30.16,16.51 180 top
R13  32.7,20 90 top
R14  35.24,16.51 180 top
R15  37.78,20 90 top
R16  40.32,16.51 180 top
R17  64.14,13.34 0 top
R18  64.14,11.43 0 top
R19  49.53,19.05 90 top
R23  2.22,28.58 90 top
R24  4.76,28.58 90 top
R25  7.3,28.58 90 top
R26  9.84,28.58 90 top
R27  12.38,28.58 90 top
R28  14.92,28.58 90 top
R29  17.46,28.58 90 top
R30  20,28.58 90 top
R31  22.54,28.58 90 top
R32  25.08,28.58 90 top
R33  27.62,28.58 90 top
R34  30.16,28.58 90 top
R35  32.7,28.58 90 top
R36  35.24,28.58 90 top
R37  37.78,28.58 90 top
R38  40.32,28.58 90 top
R39  43.18,21.27 90 top
SL1  63.18,4.13 180 top
SL3  120.65,2.86 0 top
SV1  41.59,35.56 0 top
SV2  122.87,35.56 0 top
SV3  204.15,35.56 0 top
T1  BCV27  [SOT23]  2.22,24.45 0 top
T2  BCV27  [SOT23]  4.76,20 0 top
T3  BCV27  [SOT23]  7.3,24.45 0 top
T4  BCV27  [SOT23]  9.84,20 0 top
T5  BCV27  [SOT23]  12.38,24.45 0 top
T6  BCV27  [SOT23]  14.92,20 0 top
T7  BCV27  [SOT23]  17.46,24.45 0 top
T8  BCV27  [SOT23]  20,20 0 top
T9  BCV27  [SOT23]  22.54,24.45 0 top
T10  BCV27  [SOT23]  25.08,20 0 top
T11  BCV27  [SOT23]  27.62,24.45 0 top
T12  BCV27  [SOT23]  30.16,20 0 top
T13  BCV27  [SOT23]  32.7,24.45 0 top
T14  BCV27  [SOT23]  35.24,20 0 top
T15  BCV27  [SOT23]  37.78,24.45 0 top
T16  BCV27  [SOT23]  40.32,20 0 top
TP1  43.18,18.1 0 top
U$1  124.46,12.07 0 top

### Tracks (layer width: path | path; a pad name or v marks a point on that pad's centre or on a via)
+3V3
  Top 0.254: C16.1 45.27,6.03 IC13.24 52.97,6.89 53.06,6.98 | 54.49,13.54 IC13.48 | 54.49,13.54 56.2,15.24 C21.1 | 54.49,13.54 54.21,13.82 IC13.1 53.06,11.75 | C18.1 45.4,17.14 46.04,16.51 48.26,16.51 49.06,15.71 IC13.9 49.06,11.9 49.21,11.75 53.06,11.75 | 53.06,6.98 IC13.36 53.28,5.46 54.3,4.44 C17.1 56.51,4.13 SL1.4 | 53.06,6.98 53.06,11.75
  Top 0.305: 101.28,5.71 97.79,5.71 96.84,4.76 IC14.2 C14.1 63.82,1.91 63.18,2.54 63.18,5.71 62.55,6.35 61.28,6.35 59.37,4.45 SL1.4 | 101.28,5.71 105.09,5.71 106.05,6.67 106.05,9.84 C13.+ | R19.2 45.72,20 45.4,19.68 | 45.4,19.68 C18.1 | R39.2 44.13,22.22 45.4,20.95 45.4,19.68 | R18.2 75.25,11.43 76.83,13.02 94.93,13.02 95.89,13.97 100.65,13.97 101.6,13.02 101.6,6.03 101.28,5.71
  Top 0.406: C15.1 129.5,7.27 U$1.3 126.08,7.27 123.51,9.84 121.6,9.84 119.06,12.38 114.3,12.38
  Top 0.813: C13.+ 112.08,10.16 114.3,12.38
+9V  (via drill 0.5 pad 1.7)
  Top 0.406: C20.1 119.1,7.27 U$1.1 122.18,6.09 122.24,6.03 122.24,3.18 SL3.2
  Top 0.813: SL3.2 225.11,2.86 227.65,5.4 v227.65,23.18
  Bottom 0.305: IC1.16 7.94,26.04 22.86,26.04 23.81,26.99 25.4,26.99 26.35,26.04 C2.1 | 46.67,26.04 45.41,26.04 45.4,26.04 C3.1 | C3.1 43.81,26.04 | C3.1 | 71.12,26.04 IC4.16 | 110.49,26.04 110.49,25.72 IC6.16 | 49.53,26.04 IC3.16 | 30.48,26.04 IC2.16 | 90.17,26.04 IC5.16 | 232.41,26.04 230.5,26.04 C6.1 227.65,25.72 212.72,25.72 | 212.72,25.72 C7.1 191.77,25.72 | 212.72,25.72 IC11.16 | 191.77,25.72 189.87,25.72 C8.1 171.77,26.04 | 191.77,25.72 IC10.16 | 171.77,26.04 C9.1 | 171.77,26.04 IC9.16 | C10.1 151.13,26.04 IC8.16 | C11.1 130.49,26.04 130.81,25.72 IC7.16
  Bottom 0.406: 232.41,26.04 IC12.16 | C9.1 169.86,24.77 167,21.91 166.37,21.91 166.05,21.59 162.56,21.59 161.61,22.54 161.61,25.72 161.29,26.04 151.13,26.04 | C10.1 148.91,24.45 145.73,21.27 143.83,21.27 142.56,22.54 142.56,23.81 140.33,26.04 130.49,26.04 | 110.49,25.72 110.17,26.04 C12.1 108.27,24.13 105.09,20.95 102.23,20.95 100.65,22.54 100.65,24.77 99.38,26.04 90.17,26.04 | C5.1 88.27,24.13 85.72,21.59 82.23,21.59 81.28,22.54 81.28,25.72 80.96,26.04 71.12,26.04 | C4.1 67.31,24.13 67.31,22.23 66.67,21.59 64.14,21.59 63.18,22.54 63.18,24.13 61.28,26.04 49.53,26.04
  Bottom 0.61: 7.94,26.04 C1.1 | C2.1 30.48,26.04 C3.1 46.67,26.04 49.53,26.04 | 71.12,26.04 C4.1 | 90.17,26.04 C5.1 | C12.1 110.49,26.04 C11.1
  Bottom 0.813: v227.65,23.18 227.65,25.72
B1
  Top 0.254: IC13.31 50.56,1.98 49.53,0.95 33.97,0.95
  Top 0.305: 1.27,12.7 13.02,0.95 33.97,0.95
  Top 0.406: 1.27,12.7 R1.1
B2
  Top 0.254: IC13.30 50.06,2.44 49.21,1.59 34.29,1.59
  Top 0.305: 5.4,16.19 5.71,16.19 R2.1 5.71,9.52 13.65,1.59 34.29,1.59
B3
  Top 0.254: IC13.27 48.56,3.79 48.26,3.49 38.1,3.49 36.2,5.4 33.34,5.4 31.43,3.49 25.4,3.49 23.5,5.4 11.11,5.4 7.3,9.21
  Top 0.305: 7.3,9.21 R3.1
B4
  Top 0.254: IC13.25 45.78,5.46 45.09,4.76 38.73,4.76 36.83,6.67 24.13,6.67 23.5,6.03 12.38,6.03 | R4.1
  Top 0.305: 12.38,6.03 10.79,7.62 10.79,8.25
  Top 0.406: 10.79,8.25 R4.1
B5
  Top 0.254: IC13.22 24.4,7.89 23.18,6.67 16.51,6.67
  Top 0.305: R5.1 12.38,13.97 11.75,13.34 11.75,8.25 13.34,6.67 16.51,6.67
B6
  Top 0.254: 15.87,15.87 R6.1 | IC13.21 23.95,8.39 22.86,7.3 15.88,7.3
  Top 0.305: 15.87,15.87 15.88,15.87 15.88,14.61 12.38,11.11 12.38,8.57 13.65,7.3 15.88,7.3
B7
  Top 0.254: 17.46,15.56 R7.1 | IC13.20 23.5,8.89 22.54,7.94 15.24,7.94
  Top 0.305: 15.24,7.94 13.97,7.94 13.02,8.89 13.02,10.16 17.46,14.61 17.46,15.56
B8
  Top 0.254: IC13.19 27.75,9.39 21.59,15.56 21.59,15.87 R8.1
B9
  Top 0.254: IC13.18 28.53,9.89 22.54,15.88 R9.1
B10
  Top 0.254: IC13.17 29.29,10.39 26.03,13.65
  Top 0.406: 26.03,13.65 R10.1
B11
  Top 0.254: IC13.16 30.7,10.89 27.62,13.97
  Top 0.406: 27.62,13.97 R11.1
B12
  Top 0.254: IC13.15 33.69,11.39 31.11,13.97
  Top 0.406: 31.11,13.97 R12.1
B13
  Top 0.254: IC13.14 35.1,11.89 32.7,14.29
  Top 0.406: 32.7,14.29 R13.1
B14
  Top 0.254: IC13.13 37.45,12.39 36.19,13.65
  Top 0.406: 36.19,13.65 R14.1
B15
  Top 0.254: IC13.12 38.56,13.82 37.78,14.61
  Top 0.406: 37.78,14.61 R15.1
B16
  Top 0.254: IC13.11 48.06,14.8 47.62,15.24 41.91,15.24 41.43,15.72
  Top 0.406: R16.1 41.27,15.88 41.43,15.72
CE  (via drill 0.5 pad 1.7)
  Top 0.254: IC13.38 71.35,7.39 73.03,5.71
  Top 0.305: 73.03,5.71 87,5.71 v88.27,4.45
  Bottom 0.305: v88.27,4.45 93.66,4.45 94.93,5.71 98.11,5.71 IC14.3
CLOCK  (via drill 0.5 pad 1.7)
  Top 0.254: IC13.26 48.06,4.25 47.94,4.13 38.42,4.13 36.51,6.03 31.43,6.03 v30.8,5.4
  Top 0.305: v23.81,11.11 22.23,11.11 v20.64,9.52 | v77.79,21.59 79.06,20.32 v79.06,18.41 | v96.84,21.59 97.79,20.64 v97.79,18.41 | v238.76,16.83 v238.76,19.37 | v219.07,16.83 v219.07,19.37 | v198.12,16.83 v198.12,19.37 | v178.12,16.83 v178.12,19.37 | v157.48,16.83 v157.48,19.37 | v137.16,16.83 v137.16,19.37 | v117.16,21.59 117.16,20 v118.75,18.41
  Top 0.406: v55.88,21.91 57.47,20.32 v57.47,18.1
  Bottom 0.305: IC1.11 14.29,20.32 14.92,19.68 | 20.95,9.52 v20.64,9.52 | 38.73,13.02 34.29,8.57 33.97,8.57 v30.8,5.4 25.08,5.4 | 40.32,18.1 49.85,18.1 50.16,18.41 52.7,18.41 53.02,18.1 v57.47,18.1 57.47,18.73 58.42,19.68 73.34,19.68 74.61,18.41 v79.06,18.41 v97.79,18.41 v118.75,18.41 130.49,18.41 132.08,16.83 v137.16,16.83 v157.48,16.83 v178.12,16.83 v198.12,16.83 v219.07,16.83 v238.76,16.83 | IC4.11 77.47,21.91 v77.79,21.59 | IC5.11 96.52,21.91 v96.84,21.59 | v238.76,19.37 IC12.11 | v219.07,19.37 IC11.11 | v198.12,19.37 IC10.11 | v178.12,19.37 IC9.11 | v157.48,19.37 IC8.11 | v137.16,19.37 IC7.11 | IC6.11 116.84,21.91 v117.16,21.59
  Bottom 0.406: IC2.11 36.83,15.56 33.02,11.75 24.45,11.75 v23.81,11.11 | 14.92,19.68 14.92,16.51 15.88,15.56 15.88,12.7 19.05,9.52 v20.64,9.52 | 25.08,5.4 20.95,9.52 | 38.73,13.02 39.69,13.97 39.69,17.46 40.32,18.1 | v55.88,21.91 IC3.11
DATA  (via drill 0.5 pad 1.7)
  Top 0.254: IC13.28 49.06,3.34 48.58,2.86 37.78,2.86 35.88,4.76 33.66,4.76 31.75,2.86 20.95,2.86 v19.68,4.13
  Bottom 0.406: IC1.14 10.48,11.43 17.78,4.13 v19.68,4.13
DATA_OUT
  Bottom 0.305: IC5.14 92.71,22.86 91.76,21.91 91.44,21.59 | IC4.9 80.01,22.86
  Bottom 0.406: 80.01,22.86 80.01,22.23 81.92,20.32 90.17,20.32 91.76,21.91
DATA_OUT2
  Bottom 0.305: IC8.9 160.02,19.68 160.66,19.05 173.35,19.05 174.31,20 IC9.14
GND  (via drill 0.5 pad 1.7)
  Top 0.2: 6.03,20 8.89,20 | 11.11,20 13.97,20 | 15.88,20 19.37,20 | 20.95,20 24.13,20 | 25.72,20 29.21,20 | 30.8,20 33.97,20 | 36.2,20 39.37,20 | 48.26,19.05 50.48,19.05
  Top 0.254: IC13.23 42.32,7.39 41.91,6.98 | C16.2 40.64,6.04 v40.32,6.35 | IC13.8 49.56,16.16 48.9,16.83 | 48.9,16.83 48.89,16.83 | 52.56,2.37 53.68,2.42 C17.2 | IC13.47 56.02,11.89 56.51,12.38 | 19.05,21.91 19.05,20.32 19.37,20 20.95,20 T8.2 | T1.2 3.17,20.32 2.86,20 6.03,20 5.71,19.68 T2.2 | T4.2 10.79,19.68 11.11,20 8.89,20 8.89,21.59 8.25,22.23 T3.2 | 15.87,19.37 T6.2 | T5.2 13.33,22.86 13.97,22.23 13.97,20 15.88,20 | T16.2 41.27,19.68 40.96,20 39.37,20 39.05,20.32 39.05,22.23 38.73,22.55 T15.2 | T10.2 26.03,19.69 25.72,20 24.13,20 24.13,21.59 23.49,22.23 T9.2 | T12.2 31.11,19.69 30.8,20 29.21,20 28.89,20.32 28.89,21.91 28.57,22.23 T11.2 | T14.2 36.19,20 36.2,20 33.97,20 33.97,21.91 33.65,22.23 T13.2 | 48.26,19.05 C18.2 47.94,17.46 48.26,17.14 48.58,17.14 48.9,16.83 | 51.12,21.59 50.8,21.27 50.8,19.37 50.64,19.21 50.48,19.05 | 56.51,12.38 56.52,12.38 | 56.51,12.38 56.2,12.7 56.2,13.02 | 52.56,3.18 IC13.35 | 52.56,3.18 52.56,2.42 | 52.56,3.18 v53.98,2.86
  Top 0.305: C14.2 98.74,2.86 99.38,3.49 IC14.1 | T7.2 18.41,22.55 19.05,21.91 | 15.87,19.37 15.88,19.37 15.88,20
  Top 0.406: v126.36,28.26 126.05,28.58 126.05,30.48 | T16.2 41.27,19.68 41.59,20
  Bottom 0.254: 24.45,27.94 25.08,27.94 | 4.45,12.7 4.13,13.02 | v40.32,6.35 40.64,6.67 | v53.98,2.86 53.98,2.44 53.99,2.44
  Bottom 0.305: C1.2 17.14,27.94 | 17.14,27.94 24.45,27.94 C2.2 39.69,27.94 C3.2 58.1,27.94 | C4.2 80.33,27.94 80.01,28.26 IC4.8 | 172.41,27.94 172.72,27.62 180.66,27.62 | IC1.8 16.83,28.26 17.14,27.94 | 119.38,27.94 IC6.8 | IC8.8 160.02,28.26 160.34,27.94 | 180.66,27.62 189.23,27.62 C8.2 200.66,27.94 | 180.66,27.62 IC9.8 | 200.66,27.94 210.5,27.94 C7.2 221.62,27.62 | 200.66,27.94 IC10.8 | 221.62,27.62 C6.2 240.66,27.62 241.3,28.26 IC12.8 | 221.62,27.62 IC11.8
  Bottom 0.406: IC3.8 58.42,28.26 58.1,27.94 | IC2.8 39.37,28.26 39.69,27.94 | 119.38,27.94 119.7,28.26 v126.36,28.26 | 2.86,13.34 2.54,13.65
  other vias: 163.83,23.49 102.87,23.18 42.55,27.94 82.87,23.18
  pour Bottom (isolate 0.6): 1.59,0.63 244.47,0.63 244.47,38.42 0.64,38.42 0.64,0.95 1.59,0.95
  pour Top (isolate 0.6): 1.27,1.59 244.16,1.59 244.16,38.1 1.27,38.1
IRQ
  Top 0.254: IC13.43 75.3,9.89 77.79,12.38
  Top 0.305: 77.79,12.38 96.52,12.38 IC14.8
MR  (via drill 0.5 pad 1.7)
  Top 0.254: IC13.46 59.02,11.39 60.01,12.38 60.01,14.92 61.59,16.51 61.59,19.68 60.01,21.27
  Top 0.305: v60.01,21.59 60.01,21.27
  Bottom 0.254: 60.01,20.32 v60.01,21.59
  Bottom 0.305: IC1.10 15.56,21.59 15.88,21.27 | IC3.10 57.15,22.86 57.47,22.54 57.47,20.32 | 38.1,20.64 51.44,20.64 53.02,19.05 55.88,19.05 57.15,20.32 57.47,20.32 | IC4.10 78.74,22.54 79.38,21.91 79.38,20.95 78.9,20.48 77.47,19.05 74.93,19.05 73.66,20.32 60.01,20.32 57.47,20.32 | 94.3,19.05 96.2,19.05 96.84,19.68 97.47,19.68 98.42,20.64 | IC5.10 97.79,22.86 98.42,22.23 98.42,20.64 | IC12.10 240.03,18.1 220.34,18.1 | 220.34,18.1 199.39,18.1 | 199.39,18.1 179.39,18.1 | 179.39,18.1 158.75,18.1 | 158.75,18.1 IC8.10 | 179.39,18.1 IC9.10 | 199.39,18.1 IC10.10 | 220.34,18.1 IC11.10 | 118.43,20.95 118.43,20.64 116.84,19.05 101.92,19.05 100.33,20.64 98.42,20.64 | 118.43,20.95 118.43,22.86 118.11,23.18 IC6.10 | 158.75,18.1 138.43,18.1 | 138.43,18.1 132.08,18.1 129.22,20.95 118.43,20.95 | 138.43,18.1 IC7.10
  Bottom 0.406: 15.88,21.27 15.88,17.78 17.46,16.19 17.46,12.7 19.05,11.11 21.59,11.11 23.18,9.52 25.72,9.52 26.04,9.84 33.66,9.84 38.1,14.29 38.1,20.64 IC2.10 | 94.3,19.05 93.66,19.68 80.96,19.68 80.17,20.48 78.9,20.48
N$1
  Bottom 0.305: IC2.14 33.02,22.23 32.07,21.27 26.35,21.27 23.71,23.91 IC1.9
N$2
  Bottom 0.305: IC2.9 44.67,23.91 46.99,21.59 51.12,21.59 52.07,22.54 IC3.14
N$3
  Bottom 0.305: IC4.14 73.66,22.86 71.75,20.95 63.82,20.95 60.86,23.91 IC3.9
N$4  (via drill 0.5 pad 4)
  other vias: 3.17,3.18
N$5
  Bottom 0.305: IC1.1 7.94,29.84 6.03,31.75 6.03,35.56 SV1.4
N$6
  Bottom 0.305: IC1.2 9.21,32.38 8.57,33.02 8.57,35.56 SV1.6
N$7
  Bottom 0.305: IC1.3 10.48,32.7 11.11,33.34 11.11,35.56 SV1.8
N$8
  Bottom 0.305: SV1.10 13.65,35.56 13.65,33.34 13.34,33.02 13.02,33.02 11.75,31.75 IC1.4
N$9
  Bottom 0.305: 13.02,29.84 IC1.5 13.02,31.43 14.61,33.02 15.56,33.02 16.19,33.66 16.19,35.56 SV1.12
N$10
  Bottom 0.305: SV1.14 18.73,35.56 18.73,32.7 18.41,32.38 14.92,32.38 14.29,31.75 IC1.6
N$11
  Bottom 0.305: SV1.16 21.27,35.56 21.27,33.34 19.68,31.75 16.19,31.75 15.56,31.12 IC1.7
N$12
  Bottom 0.305: SV1.2 2.54,36.83 3.49,35.88 3.49,22.86 4.13,22.23 8.57,22.23 9.21,22.86 IC1.15
N$13
  Bottom 0.305: SV1.20 26.35,35.56 26.35,33.66 29.95,30.06 IC2.1
N$14
  Bottom 0.305: SV1.22 28.89,35.56 28.89,33.34 29.53,32.7 30.8,32.7 31.75,31.75 IC2.2
N$15
  Bottom 0.305: SV1.24 31.43,35.56 31.43,33.34 33.02,31.75 IC2.3
N$16
  Bottom 0.305: SV1.26 33.97,35.56 33.97,33.97 34.29,33.66 IC2.4
N$17
  Bottom 0.305: SV1.28 36.51,35.56 36.51,33.66 35.56,32.7 IC2.5
N$18
  Bottom 0.305: SV1.30 39.05,35.56 39.05,33.34 36.83,31.12 IC2.6
N$19
  Bottom 0.305: SV1.32 41.59,35.56 41.59,33.02 40.32,31.75 38.42,31.75 38.1,31.43 IC2.7
N$20  (via drill 0.5 pad 1.7)
  Top 0.305: SV1.18 23.81,35.56 23.81,26.35 v24.77,25.4
  Bottom 0.305: IC2.15 31.75,22.54 31.43,22.23 28.89,22.23 26.35,24.77 25.4,24.77 v24.77,25.4
N$21
  Bottom 0.305: SV1.36 46.67,35.56 46.67,32.92 IC3.1
N$22
  Bottom 0.305: SV1.38 49.21,35.56 49.21,33.66 50.8,32.07 IC3.2
N$23
  Bottom 0.305: SV1.40 51.75,35.56 51.75,33.66 52.07,33.34 IC3.3
N$24
  Bottom 0.305: SV1.42 54.29,35.56 54.29,33.66 53.34,32.7 IC3.4
N$25
  Bottom 0.305: SV1.44 56.83,35.56 56.83,33.66 56.2,33.02 55.56,33.02 54.61,32.07 IC3.5
N$26
  Bottom 0.305: SV1.46 59.37,35.56 59.37,33.02 59.05,32.7 57.15,32.7 55.88,31.43 IC3.6
N$27
  Bottom 0.305: SV1.48 61.91,35.56 61.91,32.07 61.59,31.75 57.78,31.75 57.15,31.12 IC3.7
N$28  (via drill 0.5 pad 1.7)
  Top 0.305: SV1.34 41.59,35.56 41.59,32.07 45.09,28.58 45.09,26.04 v46.99,24.13
  Bottom 0.305: v46.99,24.13 47.62,23.49 47.62,23.18 48.58,22.23 50.48,22.23 50.8,22.54 IC3.15
N$29
  Bottom 0.305: SV1.52 66.99,35.56 66.99,32.7 69.53,30.16 71.02,30.16 IC4.1
N$30
  Bottom 0.305: SV1.54 69.53,35.56 69.53,33.02 70.17,32.38 71.75,32.38 72.39,31.75 IC4.2
N$31
  Bottom 0.305: SV1.56 72.07,35.56 72.07,33.66 73.66,32.07 IC4.3
N$32
  Bottom 0.305: SV1.58 74.61,35.56 74.61,33.02 74.93,32.7 IC4.4
N$33
  Bottom 0.305: SV1.60 77.15,35.56 77.15,33.02 76.2,32.07 IC4.5
N$34
  Bottom 0.305: SV1.62 79.69,35.56 79.69,33.34 78.42,32.07 77.79,32.07 77.47,31.75 IC4.6
N$35
  Bottom 0.305: SV1.64 81.28,36.83 82.23,35.88 82.23,33.02 80.96,31.75 79.38,31.75 78.74,31.12 IC4.7
N$36  (via drill 0.5 pad 1.7)
  Top 0.406: v65.41,23.18 68.9,23.18 v69.22,22.86
  Bottom 0.305: IC4.15 72.39,22.86 71.44,21.91 69.53,21.91 | SV1.50 63.18,36.51 64.45,35.24
  Bottom 0.406: v69.22,22.86 69.22,22.23 69.53,21.91 | 64.45,35.24 64.45,24.13 v65.41,23.18
N$37
  Bottom 0.305: IC5.9 99.06,22.86 102.23,19.68 111.76,19.68 112.39,20.32 112.39,21.91 113.03,22.54 IC6.14
N$38
  Bottom 0.305: IC6.9 119.38,22.54 120.33,21.59 129.54,21.59 130.18,20.95 132.4,20.95 133.35,21.91 IC7.14
N$39
  Bottom 0.305: IC7.9 139.7,19.68 140.34,19.05 152.4,19.05 153.67,20.32 IC8.14
N$40
  Bottom 0.305: SV2.4 86.04,36.51 87.31,35.24 87.31,33.02 88.9,31.43 89.85,31.43 90.17,31.12 IC5.1
N$41
  Bottom 0.305: SV2.6 89.85,35.56 89.85,33.66 91.44,32.07 IC5.2
N$42
  Bottom 0.305: SV2.8 92.39,35.56 92.39,32.38 92.71,32.07 IC5.3
N$43
  Bottom 0.305: SV2.10 94.93,35.56 94.93,32.7 93.98,31.75 IC5.4
N$44
  Bottom 0.305: SV2.12 97.47,35.56 97.47,33.66 95.25,31.43 IC5.5
N$45
  Bottom 0.305: SV2.14 100.01,35.56 100.01,33.34 99.38,32.7 97.47,32.7 96.52,31.75 IC5.6
N$46
  Bottom 0.305: SV2.16 102.55,35.56 102.55,33.34 101.28,32.07 98.42,32.07 97.79,31.43 IC5.7
N$47  (via drill 0.5 pad 1.7)
  Top 0.305: v85.09,23.18 87,23.18 v88.27,21.91
  Bottom 0.305: 84.77,35.56 SV2.2 | IC5.15 91.44,22.86 90.49,21.91 v88.27,21.91
  Bottom 0.406: v85.09,23.18 84.77,23.49 84.77,35.56
N$48
  Bottom 0.305: SV2.20 106.36,36.51 107.63,35.24 107.63,32.38 108.27,31.75 109.86,31.75 110.49,31.12 IC6.1
N$49
  Bottom 0.305: SV2.22 110.17,35.56 110.17,33.34 111.76,31.75 IC6.2
N$50
  Bottom 0.305: SV2.24 112.71,35.56 112.71,33.02 113.03,32.7 IC6.3
N$51
  Bottom 0.305: SV2.26 115.25,35.56 115.25,32.7 114.3,31.75 IC6.4
N$52
  Bottom 0.305: SV2.28 117.79,35.56 117.79,33.66 115.57,31.43 IC6.5
N$53
  Bottom 0.305: SV2.30 119.06,36.51 120.33,35.24 120.33,33.66 119.7,33.02 118.75,33.02 116.84,31.12 IC6.6
N$54
  Bottom 0.305: SV2.32 121.6,36.51 122.87,35.24 122.87,32.7 122.24,32.07 119.06,32.07 118.11,31.12 IC6.7
N$55  (via drill 0.5 pad 1.7)
  Top 0.406: v105.09,23.49 105.09,22.23 106.36,20.95 v107.63,20.95
  Bottom 0.406: SV2.18 105.09,35.56 v105.09,23.49 | v107.63,20.95 110.81,20.95 111.44,21.59 111.44,22.54 111.76,22.86 IC6.15
N$56
  Bottom 0.305: SV2.36 126.68,36.51 127.95,35.24 127.95,33.34 128.91,32.38 130.49,32.38 130.81,32.07 IC7.1
N$57
  Bottom 0.305: SV2.38 130.49,35.56 130.49,33.97 132.08,32.38 IC7.2
N$58
  Bottom 0.305: SV2.40 133.03,35.56 133.03,32.38 133.35,32.07 IC7.3
N$59
  Bottom 0.305: SV2.42 135.57,35.56 135.57,32.38 134.62,31.43 IC7.4
N$60
  Bottom 0.305: SV2.44 136.84,36.51 138.11,35.24 138.11,33.66 135.89,31.43 IC7.5
N$61
  Bottom 0.305: SV2.46 140.65,35.56 140.65,33.34 140.02,32.7 138.11,32.7 137.16,31.75 IC7.6
N$62
  Bottom 0.305: SV2.48 143.19,35.56 143.19,33.02 142.24,32.07 139.06,32.07 138.43,31.43 IC7.7
N$63  (via drill 0.5 pad 1.7)
  Top 0.305: SV2.34 124.14,36.2 122.87,34.92 122.87,27.62 v126.68,23.81
  Bottom 0.305: v126.68,23.81 127.95,23.81 129.22,22.54 129.86,22.54 130.49,21.91 131.76,21.91 132.08,22.23 IC7.15
N$64
  Bottom 0.305: SV2.52 147,36.51 148.27,35.24 148.27,33.02 149.22,32.07 150.5,32.07 151.13,31.43 IC8.1
N$65
  Bottom 0.305: SV2.54 150.81,35.56 150.81,33.66 152.4,32.07 IC8.2
N$66
  Bottom 0.305: SV2.56 153.35,35.56 153.35,32.7 153.67,32.38 IC8.3
N$67
  Bottom 0.305: SV2.58 154.62,36.51 155.89,35.24 155.89,32.38 154.94,31.43 IC8.4
N$68
  Bottom 0.305: SV2.60 157.16,36.2 158.43,34.92 158.43,33.66 156.21,31.43 IC8.5
N$69
  Bottom 0.305: SV2.62 159.7,36.51 160.97,35.24 160.97,33.02 160.66,32.7 158.75,32.7 157.48,31.43 IC8.6
N$70
  Bottom 0.305: SV2.64 163.51,35.56 163.51,32.7 162.88,32.07 159.7,32.07 158.75,31.12 IC8.7
N$71  (via drill 0.5 pad 1.7)
  Top 0.406: v145.1,23.18 145.1,21.59 146.05,20.64 v147.96,20.64
  Bottom 0.406: SV2.50 144.46,36.51 145.73,35.24 145.73,23.81 v145.1,23.18 | v147.96,20.64 151.45,20.64 152.4,21.59 IC8.15
N$72
  Top 0.305: SV1.63 SV2.1
N$73
  Top 0.305: SV1.61 79.69,35.56 84.77,35.56 SV2.3
N$74
  Top 0.305: SV1.59 77.15,33.02 87.31,33.02 SV2.5
N$75
  Top 0.305: SV1.57 73.03,34.92 75.56,32.38 89.22,32.38 SV2.7
N$76
  Top 0.305: SV1.55 73.34,31.75 91.12,31.75 SV2.9
N$77
  Top 0.305: SV1.53 67.94,34.92 71.75,31.12 92.71,31.12 96.2,34.61 SV2.11
N$78
  Top 0.305: 65.09,34.92 SV1.51 69.53,30.48 94.61,30.48 98.74,34.61 SV2.13
N$79
  Top 0.305: SV1.49 67.63,29.84 96.84,29.84 SV2.15
N$80
  Top 0.305: SV1.47 60.64,33.02 64.45,29.21 98.74,29.21 SV2.17
N$81
  Top 0.305: SV1.45 58.1,33.34 62.87,28.58 100.65,28.58 SV2.19
N$82
  Top 0.305: SV1.43 55.56,33.02 60.64,27.94 102.55,27.94 SV2.21
N$83
  Top 0.305: SV1.41 53.02,33.66 59.37,27.3 104.78,27.3 111.44,33.97 SV2.23
N$84
  Top 0.305: SV1.39 50.48,33.97 57.78,26.67 106.68,26.67 113.98,33.97 SV2.25
N$85
  Top 0.305: SV1.37 56.2,26.04 108.9,26.04 116.52,33.66 SV2.27
N$86
  Top 0.305: SV2.29 119.06,33.97 110.49,25.4 54.29,25.4 SV1.35
N$87
  Top 0.305: SV2.31 121.6,33.97 112.39,24.77 51.75,24.77 42.86,33.66 SV1.33
N$88
  Bottom 0.305: IC9.9 180.66,19.68 181.29,19.05 192.72,19.05 194.31,20.64 IC10.14
N$89
  Bottom 0.305: IC10.9 200.66,19.68 201.29,19.05 213.68,19.05 215.26,20.64 IC11.14
N$90
  Bottom 0.305: IC11.9 221.62,19.37 221.93,19.05 233.36,19.05 234.95,20.64 IC12.14
N$91
  Bottom 0.305: SV3.4 168.59,35.56 168.59,33.66 169.54,32.7 170.81,32.7 171.77,31.75 IC9.1
N$92
  Bottom 0.305: SV3.6 169.86,36.51 171.13,35.24 171.13,33.66 172.09,32.7 172.72,32.7 173.04,32.38 IC9.2
N$93
  Bottom 0.305: SV3.8 172.4,36.51 173.67,35.24 173.67,33.34 174.31,32.7 IC9.3
N$94
  Bottom 0.305: SV3.10 176.21,35.56 176.21,32.38 175.58,31.75 IC9.4
N$95
  Bottom 0.305: SV3.12 177.48,36.2 178.75,34.92 178.75,33.34 176.85,31.43 IC9.5
N$96
  Bottom 0.305: SV3.14 180.02,36.51 181.29,35.24 181.29,33.02 180.66,32.38 179.07,32.38 178.12,31.43 IC9.6
N$97
  Bottom 0.305: SV3.16 182.88,36.83 183.83,35.88 183.83,33.02 182.56,31.75 180.02,31.75 179.39,31.12 IC9.7
N$98  (via drill 0.5 pad 1.7)
  Top 0.305: v166.05,23.49 166.05,21.59 v167.32,20.32
  Bottom 0.305: SV3.2 164.78,36.2 166.05,34.92 v166.05,23.49 | v167.32,20.32 172.09,20.32 173.04,21.27 IC9.15
N$99
  Bottom 0.305: SV3.20 188.91,35.56 188.91,33.34 189.55,32.7 190.82,32.7 191.77,31.75 IC10.1
N$100
  Bottom 0.305: SV3.22 190.18,36.51 191.45,35.24 191.45,33.66 193.04,32.07 IC10.2
N$101
  Bottom 0.305: SV3.24 192.72,36.51 193.99,35.24 193.99,32.7 194.31,32.38 IC10.3
N$102
  Bottom 0.305: SV3.26 196.53,35.56 196.53,32.38 195.58,31.43 IC10.4
N$103
  Bottom 0.305: SV3.28 197.8,36.2 199.07,34.92 199.07,33.66 196.85,31.43 IC10.5
N$104
  Bottom 0.305: SV3.30 200.34,36.2 201.61,34.92 201.61,33.02 201.29,32.7 199.07,32.7 198.12,31.75 IC10.6
N$105
  Bottom 0.305: SV3.32 204.15,35.56 204.15,32.38 203.84,32.07 200.34,32.07 199.39,31.12 IC10.7
N$106  (via drill 0.5 pad 1.7)
  Top 0.305: SV3.18 185.1,36.51 186.06,35.56 203.52,35.56 204.15,34.92 204.15,29.84 198.12,23.81 192.41,23.81 v189.87,21.27
  Bottom 0.305: v189.87,21.27 191.77,21.27 193.04,22.54 IC10.15
N$107
  Bottom 0.305: SV3.36 209.23,35.56 209.23,33.34 209.55,33.02 211.14,33.02 212.72,31.43 IC11.1
N$108
  Bottom 0.305: SV3.38 210.5,36.51 211.77,35.24 211.77,33.34 212.41,32.7 213.36,32.7 214,32.07 IC11.2
N$109
  Bottom 0.305: SV3.40 213.04,36.51 214.31,35.24 214.31,33.66 215.26,32.7 IC11.3
N$110
  Bottom 0.305: SV3.42 216.85,35.56 216.85,31.43 216.53,31.12 IC11.4
N$111
  Bottom 0.305: SV3.44 218.12,36.51 219.39,35.24 219.39,33.02 217.81,31.43 IC11.5
N$112
  Bottom 0.305: SV3.46 221.93,35.56 221.93,33.02 221.62,32.7 220.34,32.7 219.07,31.43 IC11.6
N$113
  Bottom 0.305: SV3.48 224.47,35.56 224.47,32.38 223.84,31.75 221.3,31.75 220.34,30.8 IC11.7
N$114  (via drill 0.5 pad 1.7)
  Top 0.305: SV3.34 205.74,36.83 206.69,35.88 206.69,24.45 v209.87,21.27
  Bottom 0.305: v209.87,21.27 213.04,21.27 214,22.23 IC11.15
N$115
  Bottom 0.305: SV3.52 229.55,35.56 229.55,33.66 230.82,32.38 231.78,32.38 232.41,31.75 IC12.1
N$116
  Bottom 0.305: SV3.54 232.09,35.56 232.09,33.34 233.68,31.75 IC12.2
N$117
  Bottom 0.305: SV3.56 233.36,36.51 234.63,35.24 234.63,33.02 234.95,32.7 IC12.3
N$118
  Bottom 0.305: SV3.58 235.9,36.51 237.17,35.24 237.17,32.7 236.22,31.75 IC12.4
N$119
  Bottom 0.305: SV3.60 238.44,36.51 239.71,35.24 239.71,33.66 237.49,31.43 IC12.5
N$120
  Bottom 0.305: SV3.62 241.3,36.83 242.25,35.88 242.25,33.34 241.94,33.02 240.35,33.02 238.76,31.43 IC12.6
N$121
  Bottom 0.305: SV3.64 243.84,36.83 244.79,35.88 244.79,33.02 243.84,32.07 240.66,32.07 240.03,31.43 IC12.7
N$122  (via drill 0.5 pad 1.7)
  Top 0.305: SV3.50 227.01,35.56 227.01,33.66 228.92,31.75 228.92,28.58 233.04,24.45 233.04,21.27 v232.73,20.95
  Bottom 0.305: v232.73,20.95 233.04,20.95 233.68,21.59 IC12.15
N$123
  Top 0.305: SV2.33 133.67,24.77 193.36,24.77 SV3.31
N$124
  Top 0.305: SV2.35 135.57,25.4 191.45,25.4 SV3.29
N$125
  Top 0.305: SV2.37 129.22,33.97 137.16,26.04 189.55,26.04 SV3.27
N$126
  Top 0.305: SV2.39 139.38,26.67 187.64,26.67 SV3.25
N$127
  Top 0.305: SV2.41 141.29,27.3 185.74,27.3 SV3.23
N$128
  Top 0.305: SV2.43 143.19,27.94 183.83,27.94 SV3.21
N$129
  Top 0.305: SV2.45 145.1,28.58 181.93,28.58 SV3.19
N$130
  Top 0.305: SV2.47 147,29.21 180.02,29.21 SV3.17
N$131
  Top 0.305: SV3.15 178.12,29.84 148.91,29.84 SV2.49
N$132
  Top 0.305: SV2.51 150.81,30.48 176.21,30.48 SV3.13
N$133
  Top 0.305: SV2.53 152.72,31.12 174.31,31.12 SV3.11
N$134
  Top 0.305: SV2.55 154.62,31.75 172.4,31.75 SV3.9
N$135
  Top 0.305: SV2.57 156.53,32.38 170.5,32.38 SV3.7
N$136
  Top 0.305: SV2.59 157.16,33.97 158.12,33.02 168.59,33.02 SV3.5
N$137
  Top 0.305: SV2.61 159.7,35.24 160.02,35.56 167,35.56 167.32,35.24 SV3.3
N$138
  Top 0.305: SV2.63 SV3.1
N$139
  Top 0.305: R1.2 T1.1
N$140
  Top 0.254: R17.1 R18.1 62.15,10.39 IC13.44
N$141
  Top 0.305: R2.2 3.81,18.41 T2.1
N$142
  Top 0.305: R3.2 7.3,21.59 6.35,22.54 T3.1
N$143
  Top 0.305: R4.2 T4.1
N$144
  Top 0.305: R5.2 12.38,21.59 11.43,22.54 T5.1
N$145
  Top 0.305: R6.2 T6.1
N$146
  Top 0.305: R7.2 16.51,21.91 T7.1
N$147
  Top 0.305: R8.2 T8.1
N$148
  Top 0.305: R9.2 22.54,21.27 21.59,22.23 T9.1
N$149
  Top 0.305: R10.2 T10.1
N$150
  Top 0.305: R11.2 27.62,21.27 26.67,22.23 T11.1
N$151
  Top 0.305: R12.2 T12.1
N$152
  Top 0.305: R13.2 32.7,21.27 31.75,22.23 T13.1
N$153
  Top 0.305: R14.2 T14.1
N$154
  Top 0.305: R15.2 37.78,21.27 36.83,22.23 T15.1
N$155
  Top 0.305: R16.2 T16.1
N$156  (via drill 0.5 pad 4)
  other vias: 242.25,3.18
N$157  (via drill 0.5 pad 4)
  other vias: 113.03,3.18
N$159
  Top 0.305: T1.3 R23.1
N$160
  Top 0.305: T2.3 R24.1
N$161
  Top 0.305: T3.3 R25.1
N$162
  Top 0.305: T4.3 R26.1
N$163
  Top 0.305: T5.3 R27.1
N$164
  Top 0.305: T6.3 R28.1
N$165
  Top 0.305: T7.3 R29.1
N$166
  Top 0.305: T8.3 R30.1
N$167
  Top 0.305: T9.3 R31.1
N$168
  Top 0.305: T10.3 25.08,23.81 26.35,25.08 26.35,26.35 R32.1
N$169
  Top 0.305: T11.3 R33.1
N$170
  Top 0.305: T12.3 R34.1
N$171
  Top 0.305: T13.3 R35.1
N$172
  Top 0.305: T14.3 R36.1
N$173
  Top 0.305: T15.3 R37.1
N$174
  Top 0.305: T16.3 R38.1
NRST
  Top 0.254: IC13.7 50.06,16.93 49.53,17.46 R19.1
OE  (via drill 0.5 pad 1.7)
  Top 0.254: IC13.29 49.56,2.89 48.9,2.22 36.51,2.22 v35.56,3.18
  Top 0.305: v74.61,21.59 74.61,18.73 v72.39,16.51 | v93.66,21.59 93.66,18.1 v92.08,16.51 | v236.22,13.02 v236.22,19.37 | v216.53,13.02 v216.53,19.37 | v195.58,13.02 v195.58,19.37 | v175.58,13.02 v175.58,19.37 | v154.94,13.02 v154.94,19.37 | v134.62,13.02 v134.62,19.37 | v113.98,21.59 113.98,18.1 v112.39,16.51
  Top 0.406: v20.64,14.29 19.05,12.7 17.46,12.7 14.61,9.84 v14.61,9.52 | v53.34,21.91 53.34,21.27 51.44,19.37 v51.44,15.88
  Bottom 0.254: 35.56,2.86 v35.56,3.18 35.56,4.13 42.86,11.43
  Bottom 0.305: 11.75,20.32 IC1.13 | 55.24,15.56 58.1,15.56 59.37,16.83 64.45,16.83 66.04,18.41 71.75,18.41 73.03,17.14 | IC4.13 74.93,21.91 v74.61,21.59 | 73.03,17.14 v72.39,16.51 | IC5.13 93.98,21.91 v93.66,21.59 | 73.03,17.14 73.98,16.19 74.61,16.19 75.56,15.24 76.83,15.24 78.11,16.51 v92.08,16.51 93.03,15.56 99.06,15.56 100.01,16.51 v112.39,16.51 113.03,16.51 114.62,14.92 130.18,14.92 132.08,13.02 v134.62,13.02 v154.94,13.02 v175.58,13.02 v195.58,13.02 v216.53,13.02 v236.22,13.02 | v236.22,19.37 IC12.13 | v216.53,19.37 IC11.13 | v195.58,19.37 IC10.13 | v175.58,19.37 IC9.13 | v154.94,19.37 IC8.13 | v134.62,19.37 IC7.13 | IC6.13 114.3,21.91 v113.98,21.59
  Bottom 0.406: 35.56,2.86 35.24,2.54 23.81,2.54 19.68,6.67 17.46,6.67 v14.61,9.52 14.61,9.84 11.75,12.7 11.75,20.32 | IC2.13 34.29,16.83 32.7,15.24 21.59,15.24 v20.64,14.29 | 42.55,11.11 42.86,11.43 42.86,15.24 43.5,15.88 v51.44,15.88 53.02,15.88 53.66,15.24 54.93,15.24 55.24,15.56 | v53.34,21.91 IC3.13
PHOTO
  Top 0.254: IC13.10 48.56,15.25 47.94,15.88 44.13,15.88 43.18,16.83 TP1.TP
  Top 0.305: TP1.TP R39.1
RI1
  Top 0.305: R23.2 SV1.1
RI2
  Top 0.305: R24.2 SV1.3
RI3
  Top 0.305: R25.2 SV1.5
RI4
  Top 0.305: R26.2 SV1.7
RI5
  Top 0.305: R27.2 SV1.9
RI6
  Top 0.305: R28.2 SV1.11
RI7
  Top 0.305: R29.2 SV1.13
RI8
  Top 0.305: R30.2 SV1.15
RI9
  Top 0.305: R31.2 SV1.17
RI10
  Top 0.305: R32.2 SV1.19
RI11
  Top 0.305: R33.2 SV1.21
RI12
  Top 0.305: R34.2 SV1.23
RI13
  Top 0.305: R35.2 SV1.25
RI14
  Top 0.305: R36.2 SV1.27
RI15
  Top 0.305: R37.2 SV1.29
RI16
  Top 0.305: R38.2 SV1.31
SPI_CS  (via drill 0.5 pad 1.7)
  Top 0.254: IC13.42 76.07,9.39 77.47,10.8
  Top 0.305: 77.47,10.8 v85.72,10.8
  Bottom 0.305: v85.72,10.8 89.53,6.98 IC14.4
SPI_MISO  (via drill 0.5 pad 1.7)
  Top 0.254: IC13.40 76.7,8.39 76.83,8.25
  Top 0.305: 76.83,8.25 v92.08,8.25
  Bottom 0.305: v92.08,8.25 92.08,9.52 93.34,10.8 98.11,10.8 IC14.7
SPI_MOSI
  Top 0.254: IC13.41 77.47,8.89 78.11,9.52
  Top 0.305: 78.11,9.52 IC14.6
SPI_SCK
  Top 0.254: IC13.39 73.39,7.89 74.61,6.67
  Top 0.305: 74.61,6.67 93.34,6.67 94.93,8.25 98.11,8.25 IC14.5
STCP  (via drill 0.5 pad 1.7)
  Top 0.254: IC13.45 60.42,10.89 60.96,11.43 60.96,13.65 62.87,15.56
  Top 0.305: v76.2,16.83 v76.2,20.32 | v95.25,16.83 v95.25,20.32 | v237.49,14.92 v237.49,21.27 | v217.81,14.92 v217.81,21.27 | v196.85,14.92 v196.85,21.27 | v176.85,14.92 v176.85,21.27 | v156.21,14.92 v156.21,21.27 | v135.89,14.92 v135.89,21.27 | v115.57,16.83 v115.57,20.32 | 62.87,15.56 63.5,16.19 v63.5,18.1
  Top 0.406: v16.83,9.52 18.73,11.43 20.32,11.43 21.59,12.7 v22.23,12.7 | v54.61,20.32 54.61,17.14 v54.29,16.83
  Bottom 0.305: 13.02,20.64 IC1.12 | 39.69,12.07 31.43,3.81 | 41.91,16.83 50.16,16.83 50.8,17.46 52.07,17.46 52.7,16.83 v54.29,16.83 | v54.61,20.32 IC3.12 | 55.88,16.83 56.2,16.83 56.52,16.51 58.1,16.51 60.64,19.05 63.5,19.05 | 63.5,19.05 72.39,19.05 74.3,17.14 76.2,17.14 | v76.2,20.32 IC4.12 | 76.2,17.14 v76.2,16.83 | v95.25,20.32 IC5.12 | v95.25,16.83 95.25,17.14 | 76.2,17.14 90.81,17.14 91.44,17.78 94.3,17.78 v95.25,16.83 | v237.49,21.27 IC12.12 | v217.81,21.27 IC11.12 | v237.49,14.92 v217.81,14.92 v196.85,14.92 v176.85,14.92 v156.21,14.92 v135.89,14.92 135.57,15.24 131.76,15.24 130.18,16.83 v115.57,16.83 115.25,16.83 114.3,17.78 99.06,17.78 98.11,16.83 v95.25,16.83 | v196.85,21.27 IC10.12 | v176.85,21.27 IC9.12 | v156.21,21.27 IC8.12 | v135.89,21.27 IC7.12 | v115.57,20.32 IC6.12 | 63.5,19.05 v63.5,18.1
  Bottom 0.406: 13.02,20.64 13.02,16.83 14.92,14.92 14.92,11.43 v16.83,9.52 18.41,7.94 20,7.94 24.13,3.81 31.43,3.81 | IC2.12 35.56,16.19 33.34,13.97 23.5,13.97 v22.23,12.7 | 39.69,12.07 40.96,13.34 40.96,15.88 41.91,16.83 | 54.93,16.83 v54.29,16.83 55.88,16.83
SWDCLK
  Top 0.254: IC13.37 63.59,6.89 64.45,6.03 SL1.2
SWDIO
  Top 0.254: IC13.34 52.06,4.12 51.75,3.81 51.75,1.59 52.07,1.27 61.28,1.27 61.91,1.91 SL1.3

### Text on the board
koty: 39.1mm | 245.4mm